# Altium project MC1_Board.PrjPcb (part 1 of 2)
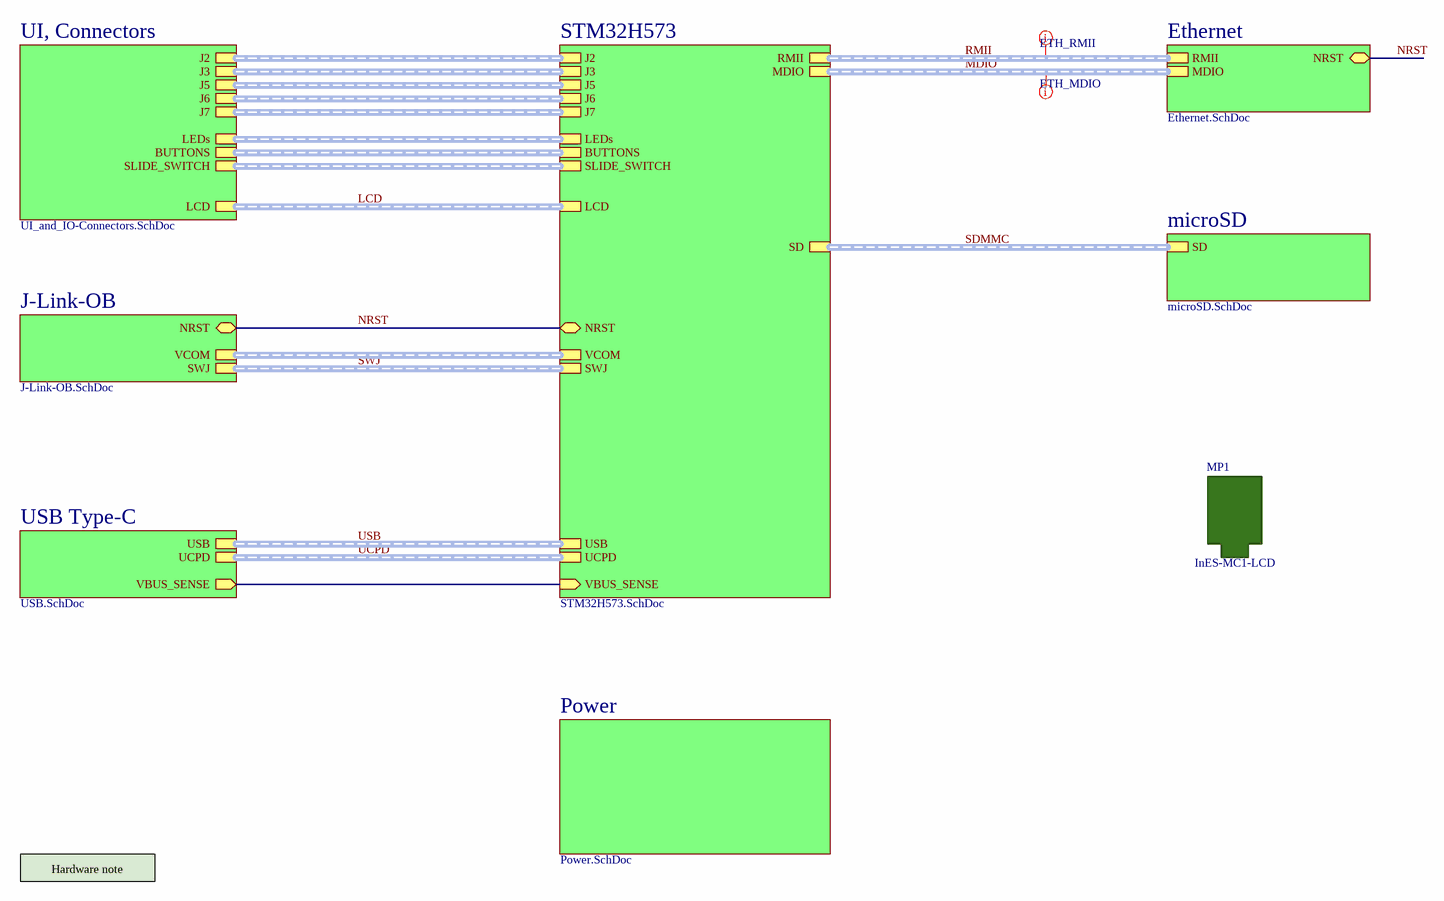
[diagram p0: MC1_Board_Gen2.SchDoc]
ProjectAddressStreet: Technikumstrasse 9; ProjectAddressZipCity: CH-8401 Winterthur; ProjectAuthor: frtt; ProjectInstitute: Institute of Embedded Systems; ProjectOrganization: Zurich University of Applied Sciences; ProjectPcbRevision: 2.01; ProjectProjectName: MC1-Board; ProjectRepository: https://github.zhaw.ch/InES/MC1_STM32H5; ProjectSchematicDate: Can be used to set a manual schematic date. Set the value of the schematic document parameter DocumentDate to =ProjectSchematicDate; ProjectSchematicDocNo: n/a; ProjectSchematicRevision: 2.01; ProjectSchematicSheetNameCommon: MC1-Board Schematic
8 sheets, 199 parts. Net scope: hierarchical (ports join the sheet entries above them; power ports are global).
Board file: MC1_Board.PcbDoc
Sheets:
  MC1_Board_Gen2.SchDoc
    USB Type-C = USB.SchDoc
    Power = Power.SchDoc
    UI, Connectors = UI_and_IO-Connectors.SchDoc
    J-Link-OB = J-Link-OB.SchDoc
    Ethernet = Ethernet.SchDoc
    microSD = microSD.SchDoc
    STM32H573 = STM32H573.SchDoc

## Sheet MC1_Board_Gen2.SchDoc
size A3; SheetNumber: 1; SheetTotal: 8; DocumentSheetName: MC1-Board Gen2; DocumentAuthor: frtt

### Parts
MP1  InES-MC1-LCD  [InES_MC1-LCD_Board_1.01-2.5-0]  (no BOM)

### Sub-sheets
Ethernet = Ethernet.SchDoc: RMII (harness RMII), NRST (bidir), MDIO (harness MDIO)
J-Link-OB = J-Link-OB.SchDoc: SWJ (harness SWJ), VCOM (harness VCOM), NRST (bidir)
microSD = microSD.SchDoc: SD (harness SD-Bus)
Power = Power.SchDoc: no entries
STM32H573 = STM32H573.SchDoc: NRST (bidir), RMII (harness RMII), SD (harness SD-Bus), USB (harness USB), SWJ (harness SWJ), LCD (harness LCD), VCOM (harness VCOM), VBUS_SENSE (in), J7 (harness J7), J5 (harness J5), J2 (harness J2), J3 (harness J3), J6 (harness J6), LEDs (harness LEDs), BUTTONS (harness BUTTONS), SLIDE_SWITCH (harness SLIDE_SWITCH), UCPD (harness UCPD), MDIO (harness MDIO)
UI, Connectors = UI_and_IO-Connectors.SchDoc: LCD (harness LCD), J2 (harness J2), J3 (harness J3), J5 (harness J5), J6 (harness J6), J7 (harness J7), SLIDE_SWITCH (harness SLIDE_SWITCH), LEDs (harness LEDs), BUTTONS (harness BUTTONS)
USB Type-C = USB.SchDoc: USB (harness USB), VBUS_SENSE (out), UCPD (harness UCPD)

### Nets
NRST: sheet J-Link-OB/NRST, sheet Ethernet/NRST, sheet STM32H573/NRST
NetC41_1: sheet USB Type-C/VBUS_SENSE, sheet STM32H573/VBUS_SENSE

### Buses and harness runs
harness LCD = sheet STM32H573/LCD = sheet UI, Connectors/LCD
harness MDIO = sheet Ethernet/MDIO = sheet STM32H573/MDIO
harness RMII = sheet Ethernet/RMII = sheet STM32H573/RMII
harness SDMMC = sheet microSD/SD = sheet STM32H573/SD
harness sheet J-Link-OB/VCOM = sheet STM32H573/VCOM
harness sheet STM32H573/BUTTONS = sheet UI, Connectors/BUTTONS
harness sheet STM32H573/J2 = sheet UI, Connectors/J2
harness sheet STM32H573/J3 = sheet UI, Connectors/J3
harness sheet STM32H573/J5 = sheet UI, Connectors/J5
harness sheet STM32H573/J6 = sheet UI, Connectors/J6
harness sheet STM32H573/J7 = sheet UI, Connectors/J7
harness sheet STM32H573/LEDs = sheet UI, Connectors/LEDs
harness sheet STM32H573/SLIDE_SWITCH = sheet UI, Connectors/SLIDE_SWITCH
harness SWJ = sheet J-Link-OB/SWJ = sheet STM32H573/SWJ
harness UCPD = sheet STM32H573/UCPD = sheet USB Type-C/UCPD
harness USB = sheet STM32H573/USB = sheet USB Type-C/USB

### Layout directives
net class ETH_RMII: (no net found under the mark)
net class ETH_MDIO: (no net found under the mark)

### Notes on the sheet
- Hardware note
- Rev
- Date
- Sign
- Release Notes
- Sheet Name
- Project Name
- Variant:
- Doc Number
- File:
- Repo:
- Revision:
- Date:
- Author:
- VC Rev:
- Sheet

### Library data of the parts
MP1 = CMP-00030-00039-1: Add-On Card, MC1 LCD Board 1.01, InES; Case/Package: n/a; Type: Add-On Card; Mounting Technology: Pluggable

## Sheet USB.SchDoc
size A3; SheetNumber: 7; SheetTotal: 8; DocumentSheetName: USB Type-C UFP; DocumentAuthor: frtt
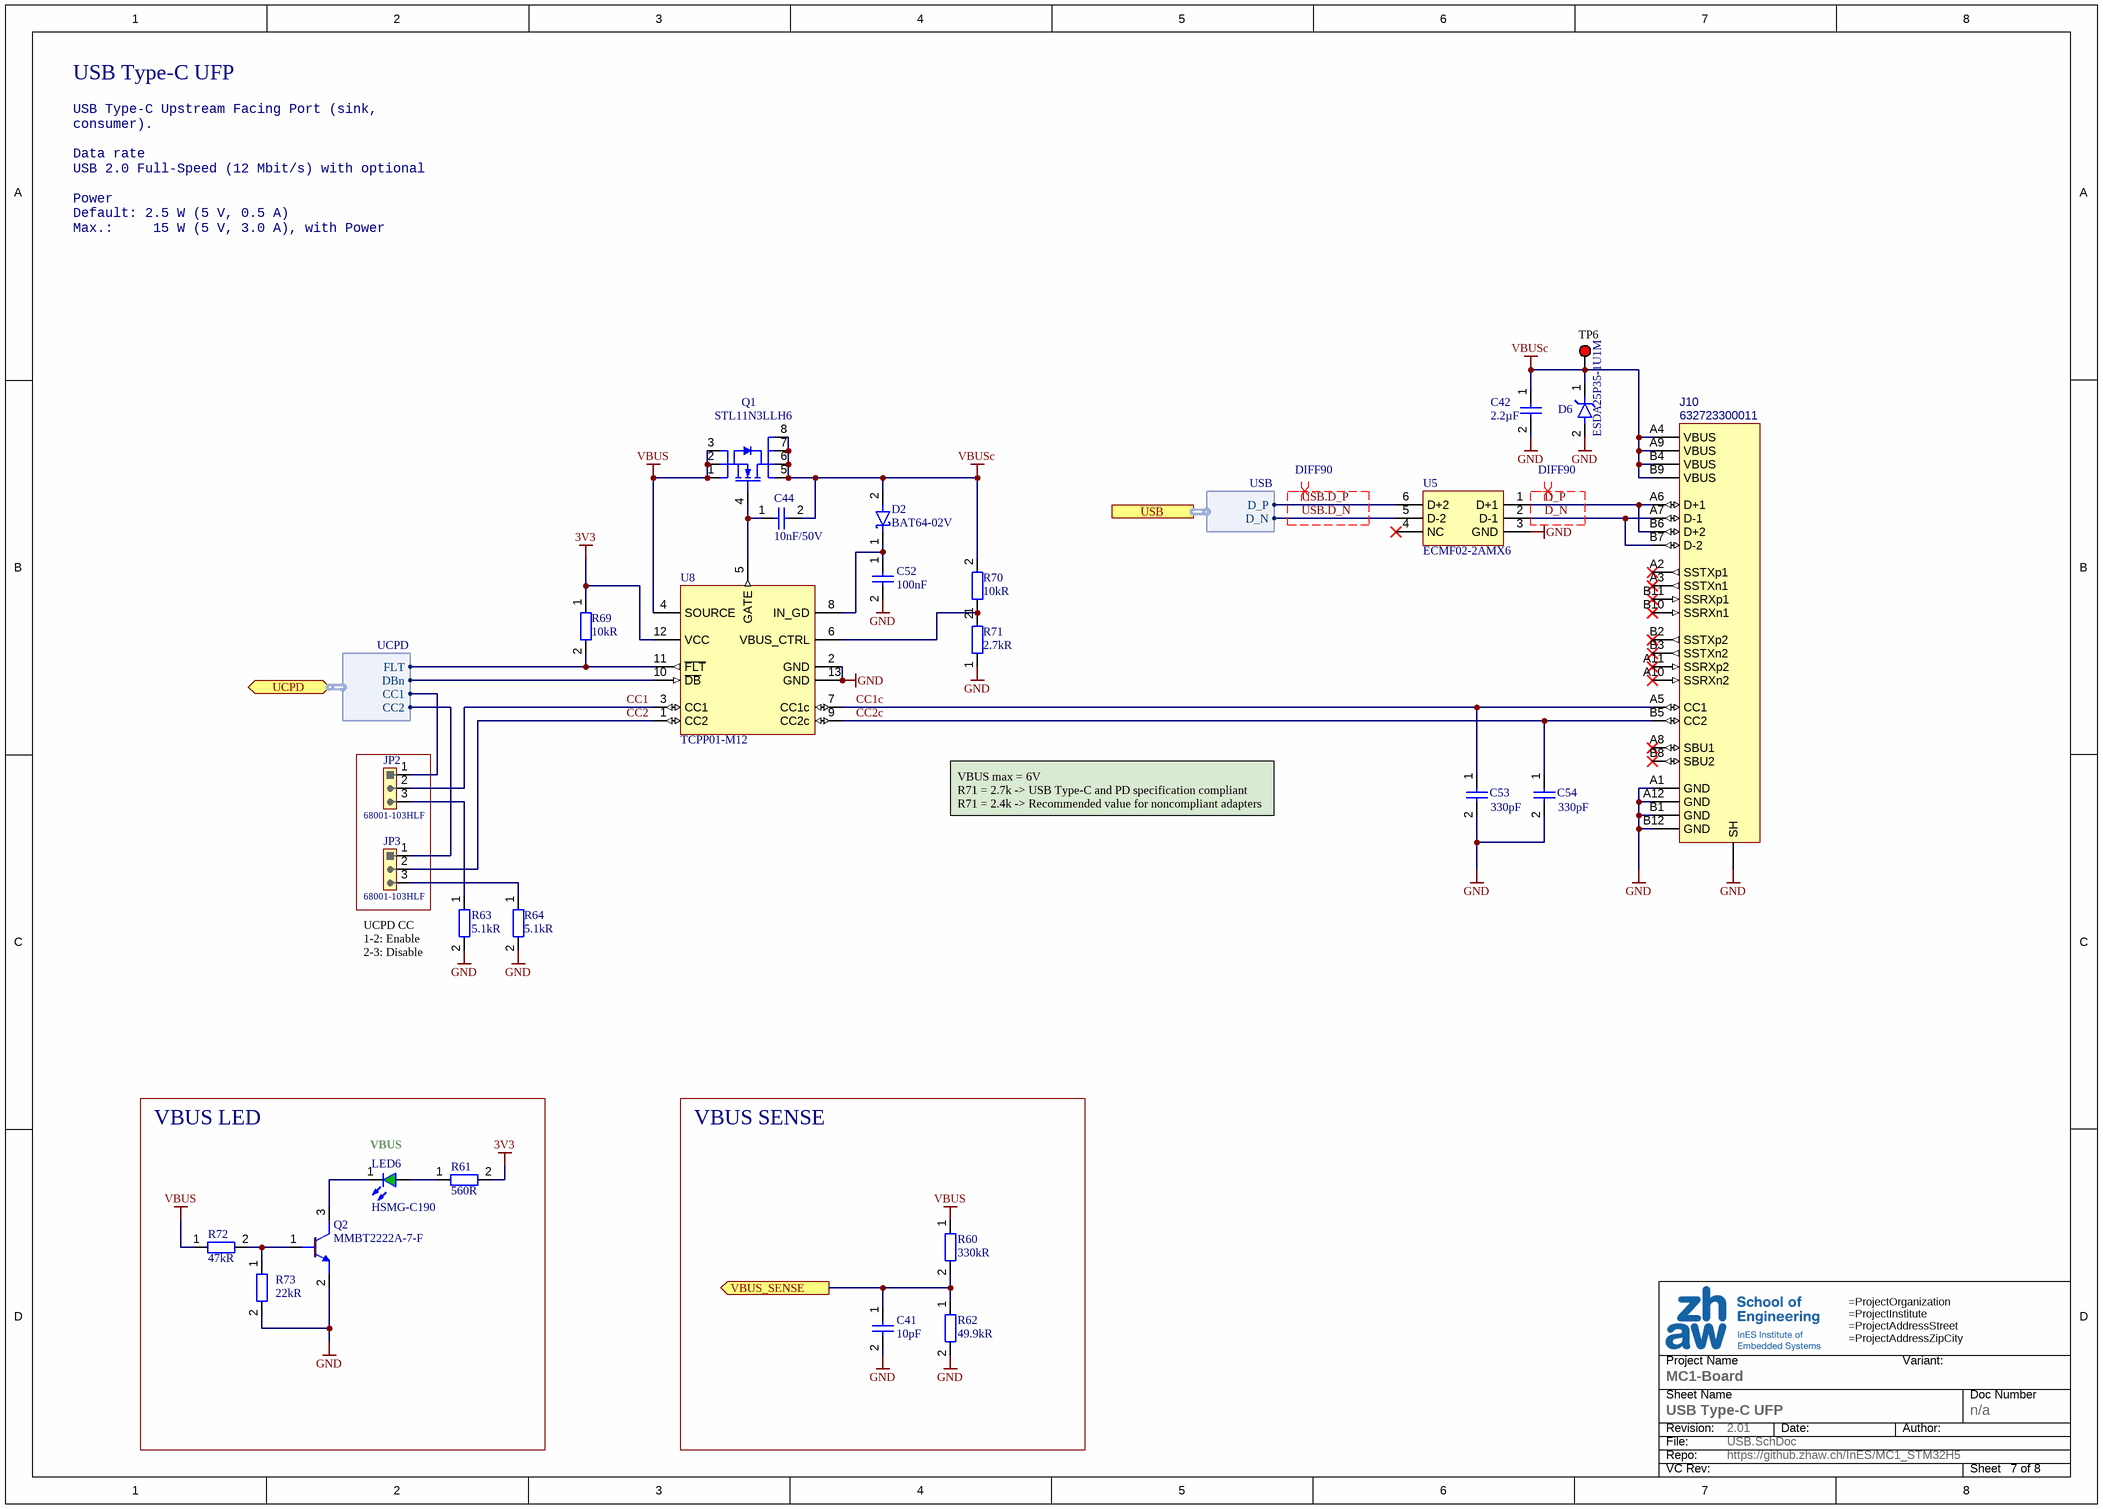
[diagram p1: USB.SchDoc]

### Parts
C41  value 10pF  [CAPC1608X80N]  (hidden comment: 10pF/50V)
C42  value 2.2µF  [CAPC1608X80N]  (hidden comment: 2.2uF/10V)
C44  10nF/50V  [CAPC1005X50N]
C52  value 100nF  [CAPC1608X80N]  (hidden comment: 100nF/50V)
C53  value 330pF  [CAPC1005X50N]  (hidden comment: 330pF/50V)
C54  value 330pF  [CAPC1005X50N]  (hidden comment: 330pF/50V)
D2  BAT64-02V  [SODFL160X65-2N]
D6  ESDA25P35-1U1M  [DFN110P160X60-2L]
J10  632723300011  [WE_632723300011]
JP2  68001-103HLF  [HD254_1x3_MV]
JP3  68001-103HLF  [HD254_1x3_MV]
LED6  HSMG-C190  [LEDSC160X80X80-2Lgn]
Q1  STL11N3LLH6  [PowerFLAT65P300X315X80-8+1]
Q2  MMBT2222A-7-F  [SOT95P235X120-3N]
R60  330kR  [RESC1608X45N]
R61  560R  [RESC1608X45N]
R62  49.9kR  [RESC1608X45N]
R63  5.1kR  [RESC1005X35N]
R64  5.1kR  [RESC1005X35N]
R69  10kR  [RESC1005X35N]
R70  10kR  [RESC1005X35N]
R71  2.7kR  [RESC1005X35N]
R72  47kR  [RESC1608X45N]
R73  22kR  [RESC1608X45N]
TP6  5000  [KSTN-5000]  (value not drawn)
U5  ECMF02-2AMX6  [QFN50P150X170X50-6N]
U8  TCPP01-M12  [QFN50P300X300X100-13T145X145N]

### Blocks framed on the sheet
VBUS LED: LED6 Q2 R61 R72 R73
VBUS SENSE: C41 R60 R62

### Ports
UCPD (bidir, harness UCPD), USB (harness USB), VBUS_SENSE (out)

### Harnesses
USB: D_P, D_N
UCPD: CC1, CC2, DBn, FLT

### Nets
3V3: R61.2 R69.1 U8.12(VCC)
GND: C41.2 C42.2 C52.2 C53.2 C54.2 D6.2(A) J10.A1(GND) J10.A12(GND) J10.B1(GND) J10.B12(GND) J10.SH Q2.2(E) R62.2 R63.2 R64.2 R71.1 R73.2 U5.3(GND) U8.2(GND) U8.13(GND)
VBUS: Q1.1(S) Q1.2(S) Q1.3(S) R60.1 R72.1 U8.4(SOURCE)
VBUSc: C42.1 C44.2 D2.2(Anode) D6.1(A) J10.A4(VBUS) J10.A9(VBUS) J10.B4(VBUS) J10.B9(VBUS) Q1.5(D) Q1.6(D) Q1.7(D) Q1.8(D) R70.2 TP6.1
CC1: JP2.2 U8.3(CC1)
CC1c: C53.1 J10.A5(CC1) U8.7(CC1c)
CC2: JP3.2 U8.1(CC2)
CC2c: C54.1 J10.B5(CC2) U8.9(CC2c)
D_N: J10.A7(D-1) J10.B7(D-2) U5.2(D-1)
D_P: J10.A6(D+1) J10.B6(D+2) U5.1(D+1)
UCPD.CC1: JP2.1 ; port UCPD.CC1
UCPD.CC2: JP3.1 ; port UCPD.CC2
UCPD.DBn: U8.10(~{DB}) ; port UCPD.DBn
UCPD.FLT: R69.2 U8.11(~{FLT}) ; port UCPD.FLT
USB.D_N: U5.5(D-2) ; port USB.D_N
USB.D_P: U5.6(D+2) ; port USB.D_P
NetC41_1: C41.1 R60.2 R62.1 ; port VBUS_SENSE
NetC44_1: C44.1 Q1.4(G) U8.5(GATE)
NetC52_1: C52.1 D2.1(Cathode) U8.8(IN_GD)
NetJP2_3: JP2.3 R63.1
NetJP3_3: JP3.3 R64.1
NetLED6_1: LED6.1(K) Q2.3(C)
NetLED6_2: LED6.2(A) R61.1
NetQ2_1: Q2.1(B) R72.2 R73.1
NetR70_1: R70.1 R71.2 U8.6(VBUS_CTRL)

Not connected (* = marked no-connect by the designer): J10 A2(SSTXp1)* A3(SSTXn1)* A8(SBU1)* A10(SSRXn2)* A11(SSRXp2)* B2(SSTXp2)* B3(SSTXn2)* B8(SBU2)* B10(SSRXn1)* B11(SSRXp1)*; U5 4(NC)*

### Layout directives
differential pair; differential pair class DIFF90: D_N, D_P, USB.D_N, USB.D_P

### Notes on the sheet
- USB Type-C UFP
- USB Type-C Upstream Facing Port (sink, consumer).
  Data rate
  USB 2.0 Full-Speed (12 Mbit/s) with optional
  Power
  Default: 2.5 W (5 V, 0.5 A)
  Max.:     15 W (5 V, 3.0 A), with Power Delivery (PD)
- VBUS max = 6V
  R71 = 2.7k -> USB Type-C and PD specification compliant
  R71 = 2.4k -> Recommended value for noncompliant adapters
- (near R63) UCPD CC
  1-2: Enable
  2-3: Disable
- (near LED6) VBUS
- Sheet Name
- Project Name
- Variant:
- Doc Number
- File:
- Repo:
- Revision:
- Date:
- Author:
- VC Rev:
- Sheet

### Library data of the parts
C41 = CMP-001-00014-21: Cap MLCC, 10pF, 50V, C0G, 5%, 0603; Type: MLCC; Case/Package: 0603; Voltage Rating: 50V; Case Code (Metric): 1608; Mounting Technology: SMD; Tolerance: 5%; Dielectricum: C0G
C42 = CMP-00353-4: Cap MLCC, 2.2uF, 10V, X7R, 10%, 0603; Case Code (Metric): 1608; Case/Package: 0603; Tolerance: 10%; Mounting Technology: SMD; Type: MLCC; Dielectricum: X7R; Voltage Rating: 10V
C44 = CMP-001-00069-21: Cap MLCC, 10nF, 50V, X7R, 10%, 0402; Tolerance: 10%; Type: MLCC; Voltage Rating: 50V; Case Code (Metric): 1005; Mounting Technology: SMD; Case/Package: 0402; Dielectricum: X7R; Value: 10nF
C52 = CMP-001-00017-21: Cap MLCC, 100nF, 50V, X7R, 10%, 0603; Voltage Rating: 50V; Dielectricum: X7R; Tolerance: 10%; Type: MLCC; Mounting Technology: SMD; Case Code (Metric): 1608; Case/Package: 0603
C53 C54 = CMP-001-00094-19: Cap MLCC, 330pF, 50V, C0G, 5%, 0402; Type: MLCC; Dielectricum: C0G; Voltage Rating: 50V; Case/Package: 0402; Mounting Technology: SMD; Tolerance: 5%; Case Code (Metric): 1005
D2 = CMP-004-00068-26: Schottky Diode, 40V, 250mA, SOD-523FL-2; Type: SOD123; Voltage: 40V; Current: 250mA; Mounting Technology: SMD; Case/Package: SOD-523FL-2
D6 = CMP-004-00023-26: TVS Diode, unidirectional, 22V, 35A, 1400W, 1610 (0603); Peak Power: 1.4kW; Connection: single; Size: L1.6B1H0.55; Peak Current: 35A; Rated Voltage: 22V; Direction: unidirectional; Case Code (Metric): 1610; Case/Package: 0603; Mounting Technology: SMD
J10 = CMP-220-000000-8: USB-C, 24 Pin, Pitch 500um, 20V, Horizontal, SMD/THT, L11.2B8.74H2.96; Manufacturer: Wurth Elektronik; Pitch: 500µm; Max Current: 5A; Gender: Female; Connection: Pluggable; Pin Mapping: 2x12; Family Name: WR-USB Connectors; Mounting Technology: SMD/THT; Angle: Horizontal; Type: USB-C; Pins: 24; Max Voltage: 20V; Size: L11.2B8.74H2.96
JP2 JP3 = CMP-002-00127-12: Header, 1x3 Pin, Pitch 2.54mm, Male, Vertical, THT; Manufacturer: FCI; Mating Length: 5.84mm; Plating: Gold; Overall Contact Length: 11.43mm; Termination Length: 3.05mm; Pitch Row: 2.54mm; Pin Mapping: 1x3; Pins: 3; Mounting Technology: THT; Angle: Vertical; Pitch: 2.54mm; Insulation Height: 2.54mm; Gender: Male
LED6 = CMP-007-00013-24: LED, Green, 20mA, 2.2V, 0603; Case/Package: 0603; Rated Current: 20mA; Forward Voltage: 2.2V; Size: L1.6B0.8H0.8; Color: Green; Mounting Technology: SMD
Q1 = CMP-00725-7: MOSFET N-enh, 30V, 11A, 44Ap, 6mR, 50W, PowerFLAT 3.3 x 3.3; Resistance: 6m; Current peak: 44A; Type: MOSFET; Power: 50W; Case/Package: PowerFLAT 3.3 x 3.3; Mounting Technology: SMD; Current: 11A; Technology: N-enhancement; Voltage: 30V; Size: L3.15B3.0H0.8
Q2 = CMP-013-00084-8: Transistor NPN, 40V, 600mA, 310mW, SOT-23-3; Current: 600mA; Case/Package: SOT-23-3; Voltage: 40V; Power: 310mW; Type: Transistor; Mounting Technology: SMD; Technology: NPN
R60 = CMP-009-00448-5: Res, 330kR, 1%, 0.1W, 0603; Value: 330k; Voltage Rating: 75V; Power: 100mW; Temperature Coefficient: 100ppm; Case/Package: 0603; Type: Fixed; Case Code (Metric): 1608; Tolerance: 1%; Mounting Technology: SMD
R61 = CMP-00862-1: Res, 560R, 1%, 100mW, 0603; Voltage Rating: 75V; Value: 560; Tolerance: 1%; Case/Package: 0603; Mounting Technology: SMD; Type: Fixed; Power: 100mW; Case Code (Metric): 1608
R62 = CMP-00778-2: Res, 49.9kR, 1%, 100mW, 0603; Value: 49.9k; Voltage Rating: 75V; Temperature Coefficient: 100ppm; Case Code (Metric): 1608; Power: 100mW; Case/Package: 0603; Tolerance: 1%; Type: Fixed; Size: L1.6B0.8H0.45; Mounting Technology: SMD
R63 R64 = CMP-009-00255-13: Res, 5.1kR, 1%, 0.063W, 0402; Voltage Rating: 50V; Value: 5.1k; Power: 63mW; Case/Package: 0402; Case Code (Metric): 1005; Tolerance: 1%; Mounting Technology: SMD; Type: Fixed
R69 R70 = CMP-009-00298-12: Res, 10kR, 1%, 0.063W, 0402; Value: 10k; Power: 63mW; Voltage Rating: 50V; Tolerance: 1%; Type: Fixed; Case Code (Metric): 1005; Case/Package: 0402; Mounting Technology: SMD
R71 = CMP-009-00214-21: Res, 2.7kR, 1%, 0.063W, 0402; Value: 2.7k; Power: 63mW; Voltage Rating: 50V; Type: Fixed; Mounting Technology: SMD; Case/Package: 0402; Case Code (Metric): 1005; Tolerance: 1%
R72 = CMP-009-00436-5: Res, 47kR, 1%, 0.1W, 0603; Voltage Rating: 75V; Temperature Coefficient: 100ppm/°C; Power: 100mW; Value: 47k; Case/Package: 0603; Case Code (Metric): 1608; Mounting Technology: SMD; Type: Fixed; Tolerance: 1%
R73 = CMP-009-00438-5: Res, 22kR, 1%, 0.1W, 0603; Voltage Rating: 75V; Temperature Coefficient: 100ppm; Value: 22k; Power: 100mW; Tolerance: 1%; Case Code (Metric): 1608; Mounting Technology: SMD; Type: Fixed; Case/Package: 0603
TP6 = CMP-00067-9: Test Point, Red, D2.5H4.6, THT, closed ring D1.25; Mounting Technology: THT; Color: Red; Size: D2.5H4.6
U5 = CMP-00721-6: ESD Common Mode Filter, Diodes and CM-Chocke, 6Vbr, 1.8ohm, 8kVpp, uQFN-6L, USB 2.0, MIPI D-PHY/MDDI; Specification: 6Vbr, 1.8ohm, 8kVpp; Type: ESD Common Mode Filter; Size: L1.7B1.5H0.5; Case/Package: uQFN-6L; Mounting Technology: SMD; Connection: Diodes and CM-Chocke
U8 = CMP-00861-5: USB Type-C and Power Delivery Protection, 2.7...22V, QFN-12; Max Supply Voltage: 22V; Min Supply Voltage: 2.7V; Case/Package: QFN-12; Mounting Technology: SMD; Function: USB Type-C and Power Delivery Protection; Size: L3.00B3.00H0.90

## Sheet Power.SchDoc
size A3; SheetNumber: 3; SheetTotal: 8; DocumentSheetName: Power; DocumentAuthor: frtt
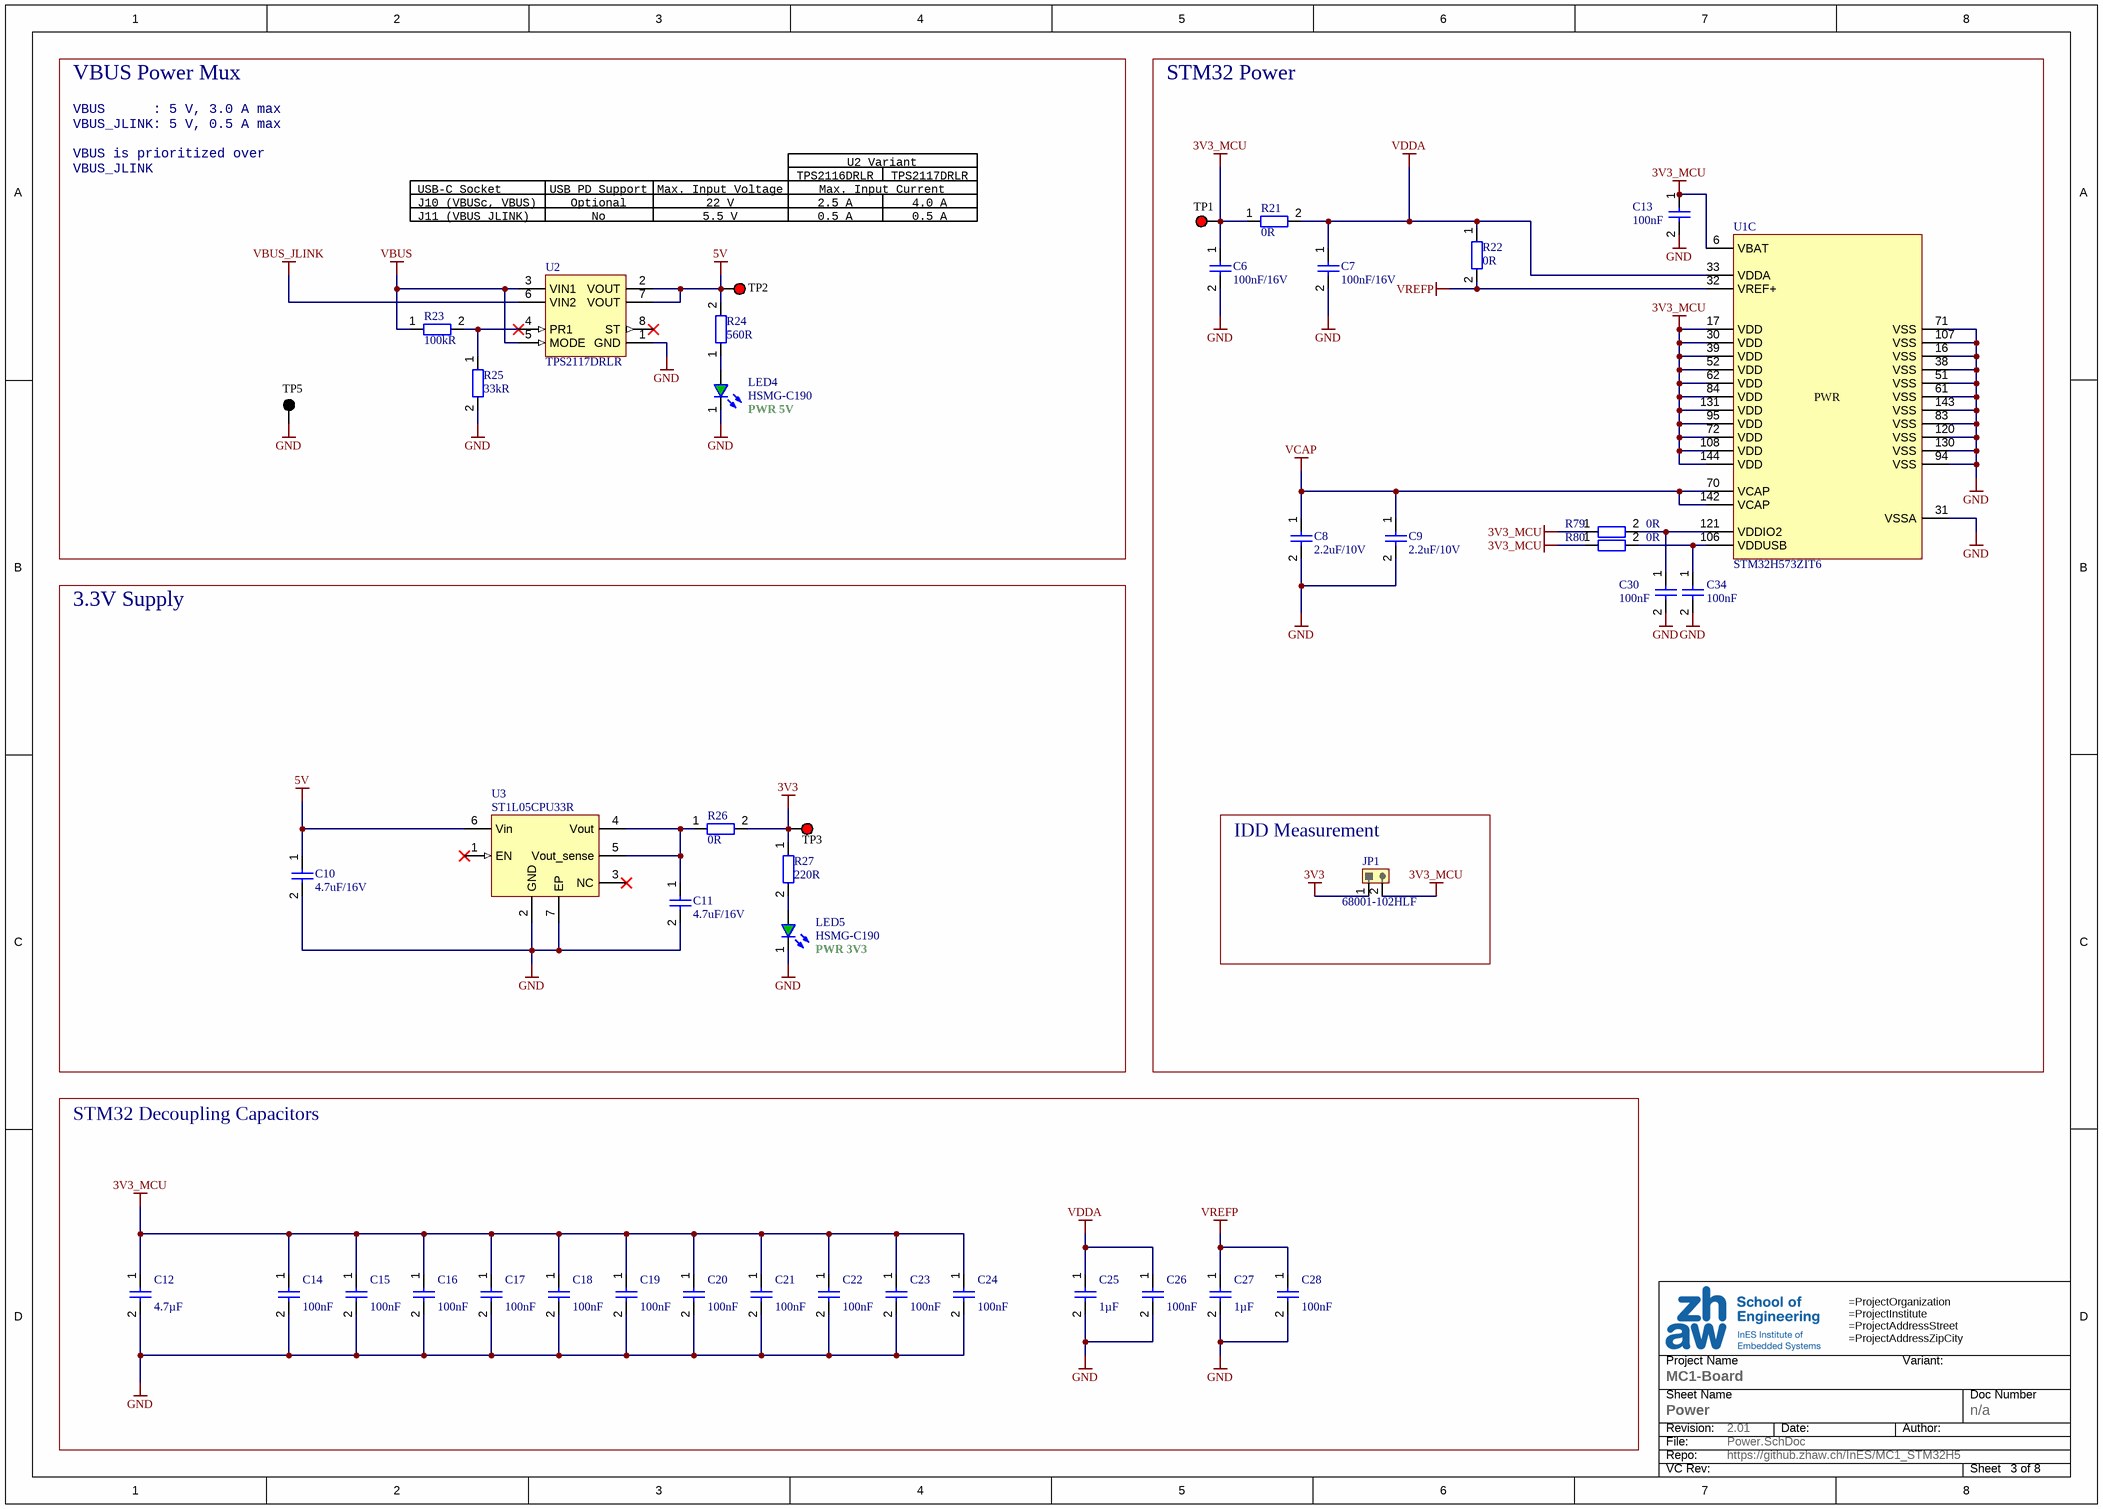
[diagram p2: Power.SchDoc]

### Parts
C6  100nF/16V  [CAPC1005X50N]
C7  100nF/16V  [CAPC1005X50N]
C8  2.2uF/10V  [CAPC1608X80N]
C9  2.2uF/10V  [CAPC1608X80N]
C10  4.7uF/16V  [CAPC1608X80N]
C11  4.7uF/16V  [CAPC1608X80N]
C12  value 4.7µF  [CAPC1608X80N]  (hidden comment: 4.7uF/16V)
C13  value 100nF  [CAPC1005X50N]  (hidden comment: 100nF/16V)
C14  value 100nF  [CAPC1005X50N]  (hidden comment: 100nF/16V)
C15  value 100nF  [CAPC1005X50N]  (hidden comment: 100nF/16V)
C16  value 100nF  [CAPC1005X50N]  (hidden comment: 100nF/16V)
C17  value 100nF  [CAPC1005X50N]  (hidden comment: 100nF/16V)
C18  value 100nF  [CAPC1005X50N]  (hidden comment: 100nF/16V)
C19  value 100nF  [CAPC1005X50N]  (hidden comment: 100nF/16V)
C20  value 100nF  [CAPC1005X50N]  (hidden comment: 100nF/16V)
C21  value 100nF  [CAPC1005X50N]  (hidden comment: 100nF/16V)
C22  value 100nF  [CAPC1005X50N]  (hidden comment: 100nF/16V)
C23  value 100nF  [CAPC1005X50N]  (hidden comment: 100nF/16V)
C24  value 100nF  [CAPC1005X50N]  (hidden comment: 100nF/16V)
C25  value 1µF  [CAPC1608X80N]  (hidden comment: 1uF/16V)
C26  value 100nF  [CAPC1005X50N]  (hidden comment: 100nF/16V)
C27  value 1µF  [CAPC1608X80N]  (hidden comment: 1uF/16V)
C28  value 100nF  [CAPC1005X50N]  (hidden comment: 100nF/16V)
C30  value 100nF  [CAPC1005X50N]  (hidden comment: 100nF/16V)
C34  value 100nF  [CAPC1005X50N]  (hidden comment: 100nF/16V)
JP1  68001-102HLF  [HD254 _1x2_MV]
LED4  HSMG-C190  [LEDSC160X80X80-2Lgn]
LED5  HSMG-C190  [LEDSC160X80X80-2Lgn]
R21  0R  [RESC1608X45N]
R22  0R  [RESC1608X45N]
R23  100kR  [RESC1608X45N]
R24  560R  [RESC1608X45N]
R25  33kR  [RESC1608X45N]
R26  0R  [RESC1608X45N_JUMPER]
R27  220R  [RESC1608X45N]
R79  0R  [RESC1005X35N_JUMPER]
R80  0R  [RESC1005X35N_JUMPER]
TP1  5000  [KSTN-5000]  (value not drawn)
TP2  5000  [KSTN-5000]  (value not drawn)
TP3  5000  [KSTN-5000]  (value not drawn)
TP5  5001  [KSTN-5001]  (value not drawn)
U1  STM32H573ZIT6  [LQFP50P2200X2200X160-144N]  (part C of 3)
U2  TPS2117DRLR  [SOTFL50P160X60-8L]
U3  ST1L05CPU33R  [SON95P300X95-7T250X160L]

### Blocks framed on the sheet
VBUS Power Mux: LED4 R23-R25 TP2 TP5 U2
STM32 Power: C6-C9 C13 C30 C34 R21 R22 R79 R80 TP1 U1
3.3V Supply: C10 C11 LED5 R26 R27 TP3 U3
IDD Measurement: JP1
STM32 Decoupling Capacitors: C12 C14-C28

### Nets
3V3: JP1.1 R26.2 R27.1 TP3.1
3V3_MCU: C6.1 C12.1 C13.1 C14.1 C15.1 C16.1 C17.1 C18.1 C19.1 C20.1 C21.1 C22.1 C23.1 C24.1 JP1.2 R21.1 R79.1 R80.1 TP1.1 U1.6(VBAT) U1.17(VDD) U1.30(VDD) U1.39(VDD) U1.52(VDD) U1.62(VDD) U1.72(VDD) U1.84(VDD) U1.95(VDD) U1.108(VDD) U1.131(VDD) U1.144(VDD)
5V: C10.1 R24.2 TP2.1 U2.2(VOUT) U2.7(VOUT) U3.6(Vin)
GND: C6.2 C7.2 C8.2 C9.2 C10.2 C11.2 C12.2 C13.2 C14.2 C15.2 C16.2 C17.2 C18.2 C19.2 C20.2 C21.2 C22.2 C23.2 C24.2 C25.2 C26.2 C27.2 C28.2 C30.2 C34.2 LED4.1(K) LED5.1(K) R25.2 TP5.1 U1.16(VSS) U1.31(VSSA) U1.38(VSS) U1.51(VSS) U1.61(VSS) U1.71(VSS) U1.83(VSS) U1.94(VSS) U1.107(VSS) U1.120(VSS) U1.130(VSS) U1.143(VSS) U2.1(GND) U3.2(GND) U3.7(EP)
VBUS: R23.1 U2.3(VIN1) U2.5(MODE)
VBUS_JLINK: U2.6(VIN2)
VCAP: C8.1 C9.1 U1.70(VCAP) U1.142(VCAP)
VDDA: C7.1 C25.1 C26.1 R21.2 R22.1 U1.33(VDDA)
VREFP: C27.1 C28.1 R22.2 U1.32(VREF+)
NetC11_1: C11.1 R26.1 U3.4(Vout) U3.5(Vout_sense)
NetC30_1: C30.1 R79.2 U1.121(VDDIO2)
NetC34_1: C34.1 R80.2 U1.106(VDDUSB)
NetLED4_2: LED4.2(A) R24.1
NetLED5_2: LED5.2(A) R27.2
NetR23_2: R23.2 R25.1 U2.4(PR1)

Not connected (* = marked no-connect by the designer): U2 8(ST)*; U3 1(EN)* 3(NC)*

### Notes on the sheet
- VBUS      : 5 V, 3.0 A max
  VBUS_JLINK: 5 V, 0.5 A max
  VBUS is prioritized over VBUS_JLINK
- U2 Variant
- TPS2116DRLR
- TPS2117DRLR
- USB-C Socket
- J10 (VBUSc, VBUS)
- J11 (VBUS_JLINK)
- USB PD Support
- Optional
- No
- Max. Input Voltage
- 22 V
- 5.5 V
- Max. Input Current
- 2.5 A
- 0.5 A
- 4.0 A
- (near LED4) PWR 5V
- (near LED5) PWR 3V3
- Sheet Name
- Project Name
- Variant:
- Doc Number
- File:
- Repo:
- Revision:
- Date:
- Author:
- VC Rev:
- Sheet
- (in symbol CMP-00715-8, part C) PWR

### Library data of the parts
C6 C7 C13-C24 C26 C28 C30 C34 = CMP-001-00001-22: Cap MLCC, 100nF, 16V, X7R, 5%,  0402; Dielectricum: X7R; Type: MLCC; Case Code (Metric): 1005; Voltage Rating: 16V; Case/Package: 0402; Mounting Technology: SMD; Tolerance: 5%
  C6 C7: Value: 100nF
C8 C9 = CMP-00353-4: Cap MLCC, 2.2uF, 10V, X7R, 10%, 0603; Value: 2.2µF; Case Code (Metric): 1608; Case/Package: 0603; Tolerance: 10%; Mounting Technology: SMD; Type: MLCC; Dielectricum: X7R; Voltage Rating: 10V
C10 C11 = CMP-00443-4: Cap MLCC, 4.7uF, 16V, X7R, 10%, 0603; Value: 4.7µF; Voltage Rating: 16V; Mounting Technology: SMD; Tolerance: 10%; Case/Package: 0603; Type: MLCC; Case Code (Metric): 1608; Dielectricum: X7R
C12 = CMP-00443-4: Cap MLCC, 4.7uF, 16V, X7R, 10%, 0603; Voltage Rating: 16V; Mounting Technology: SMD; Tolerance: 10%; Case/Package: 0603; Type: MLCC; Case Code (Metric): 1608; Dielectricum: X7R
C25 C27 = CMP-001-00004-21: Cap MLCC, 1uF, 16V, X7R, 10%, 0603; Type: MLCC; Mounting Technology: SMD; Case Code (Metric): 1608; Tolerance: 10%; Dielectricum: X7R; Case/Package: 0603; Voltage Rating: 16V
JP1 = CMP-002-00102-13: Header, 1x2 Pin, Pitch 2.54mm, Male, Vertical, THT; Manufacturer: FCI; Mating Length: 5.84mm; Overall Contact Length: 11.43mm; Plating: Gold; Gender: Male; Insulation Height: 2.54mm; Pitch: 2.54mm; Mounting Technology: THT; Angle: Vertical; Pin Mapping: 1x2; Pins: 2; Termination Length: 3.05mm; Pitch Row: 2.54mm
LED4 LED5 = CMP-007-00013-24: LED, Green, 20mA, 2.2V, 0603; Case/Package: 0603; Rated Current: 20mA; Forward Voltage: 2.2V; Size: L1.6B0.8H0.8; Color: Green; Mounting Technology: SMD
R21 R22 = CMP-009-00006-33: Res, 0R, 1%, 0.1W, 0603; Value: 0; Voltage Rating: 75V; Power: 100mW; Type: Fixed; Case Code (Metric): 1608; Tolerance: 1%; Case/Package: 0603; Mounting Technology: SMD
R23 = CMP-009-00023-34: Res, 100kR, 1%, 0.1W, 0603; Power: 100mW; Value: 100k; Voltage Rating: 50V; Mounting Technology: SMD; Case/Package: 0603; Tolerance: 1%; Case Code (Metric): 1608; Type: Fixed
R24 = CMP-00862-1: as R61 on sheet USB; Tolerance: 1%; Case/Package: 0603; Mounting Technology: SMD; Type: Fixed; Power: 100mW; Case Code (Metric): 1608
R25 = CMP-009-00580-5: Res, 33kR, 1%, 0.1W, 0603; Power: 100mW; Voltage Rating: 75V; Value: 33k; Mounting Technology: SMD; Tolerance: 1%; Case/Package: 0603; Case Code (Metric): 1608; Type: Fixed
R26 = CMP-009-00006-33: Res, 0R, 1%, 0.1W, 0603; Voltage Rating: 75V; Value: 0; Power: 100mW; Tolerance: 1%; Type: Fixed; Case Code (Metric): 1608; Mounting Technology: SMD; Case/Package: 0603
R27 = CMP-009-00452-5: Res, 220R, 1%, 0.1W, 0603; Voltage Rating: 75V; Value: 220; Temperature Coefficient: 100ppm/°C; Power: 100mW; Mounting Technology: SMD; Case Code (Metric): 1608; Case/Package: 0603; Tolerance: 1%; Type: Fixed
R79 R80 = CMP-009-00148-34: Res, 0R, 1%, 0.063W, 0402; Value: 0; Power: 63mW; Voltage Rating: 50V; Case/Package: 0402; Tolerance: 1%; Mounting Technology: SMD; Case Code (Metric): 1005; Type: Fixed
TP1-TP3 = CMP-00067-9: as TP6 on sheet USB; Mounting Technology: THT; Color: Red; Size: D2.5H4.6
TP5 = CMP-00068-8: Test Point, Black, D2.5H4.6, THT, closed ring D1.25; Color: Black; Size: D2.5H4.6; Mounting Technology: THT
U1 = CMP-00715-8: Microcontroller, STM32, ARM Cortex-M33, 250MHz, Flash 2MB, RAM 640kB, 32bit, LQFP-144; Bit: 32; Min Supply Voltage: 1.71V; Max Supply Voltage: 3.6V; Frequency: 250MHz; Size: L20B20H1.6; Type: Microcontroller; RAM Size: 640kB; Case/Package: LQFP-144; Family: STM32, ARM Cortex-M33; Flash Size: 2MB; Mounting Technology: SMD
U2 = CMP-00817-5: Power MUX, 1.6V..5.5V, Power 1.6V..5V, 4A, SOT-583; Min Logic Voltage: 1.6V; Max Power Voltage: 5.5V; Mounting Technology: SMD; Function: Power MUX; Min Power Voltage: 1.6V; Case/Package: SOT-583; Max Logic Voltage: 5.5V; Size: L2.1B1.2H0.6; Max Current: 4A
U3 = CMP-00717-5: LinReg, Fixed, 3.3V, 1.3A, 5.5Vin, 300mV Dropout, DFN-6; Max Out Voltage: 3.3825V; Max In Voltage: 5.5V; Min Out Voltage: 3.2175V; Size: L3B3H0.9; Type: Fixed; Case/Package: DFN-6; Mounting Technology: SMD; Max Out Current: 1.3A; Dropout Voltage: 300mV

## Sheet UI_and_IO-Connectors.SchDoc
size A3; SheetNumber: 4; SheetTotal: 8; DocumentSheetName: I/O; DocumentAuthor: frtt
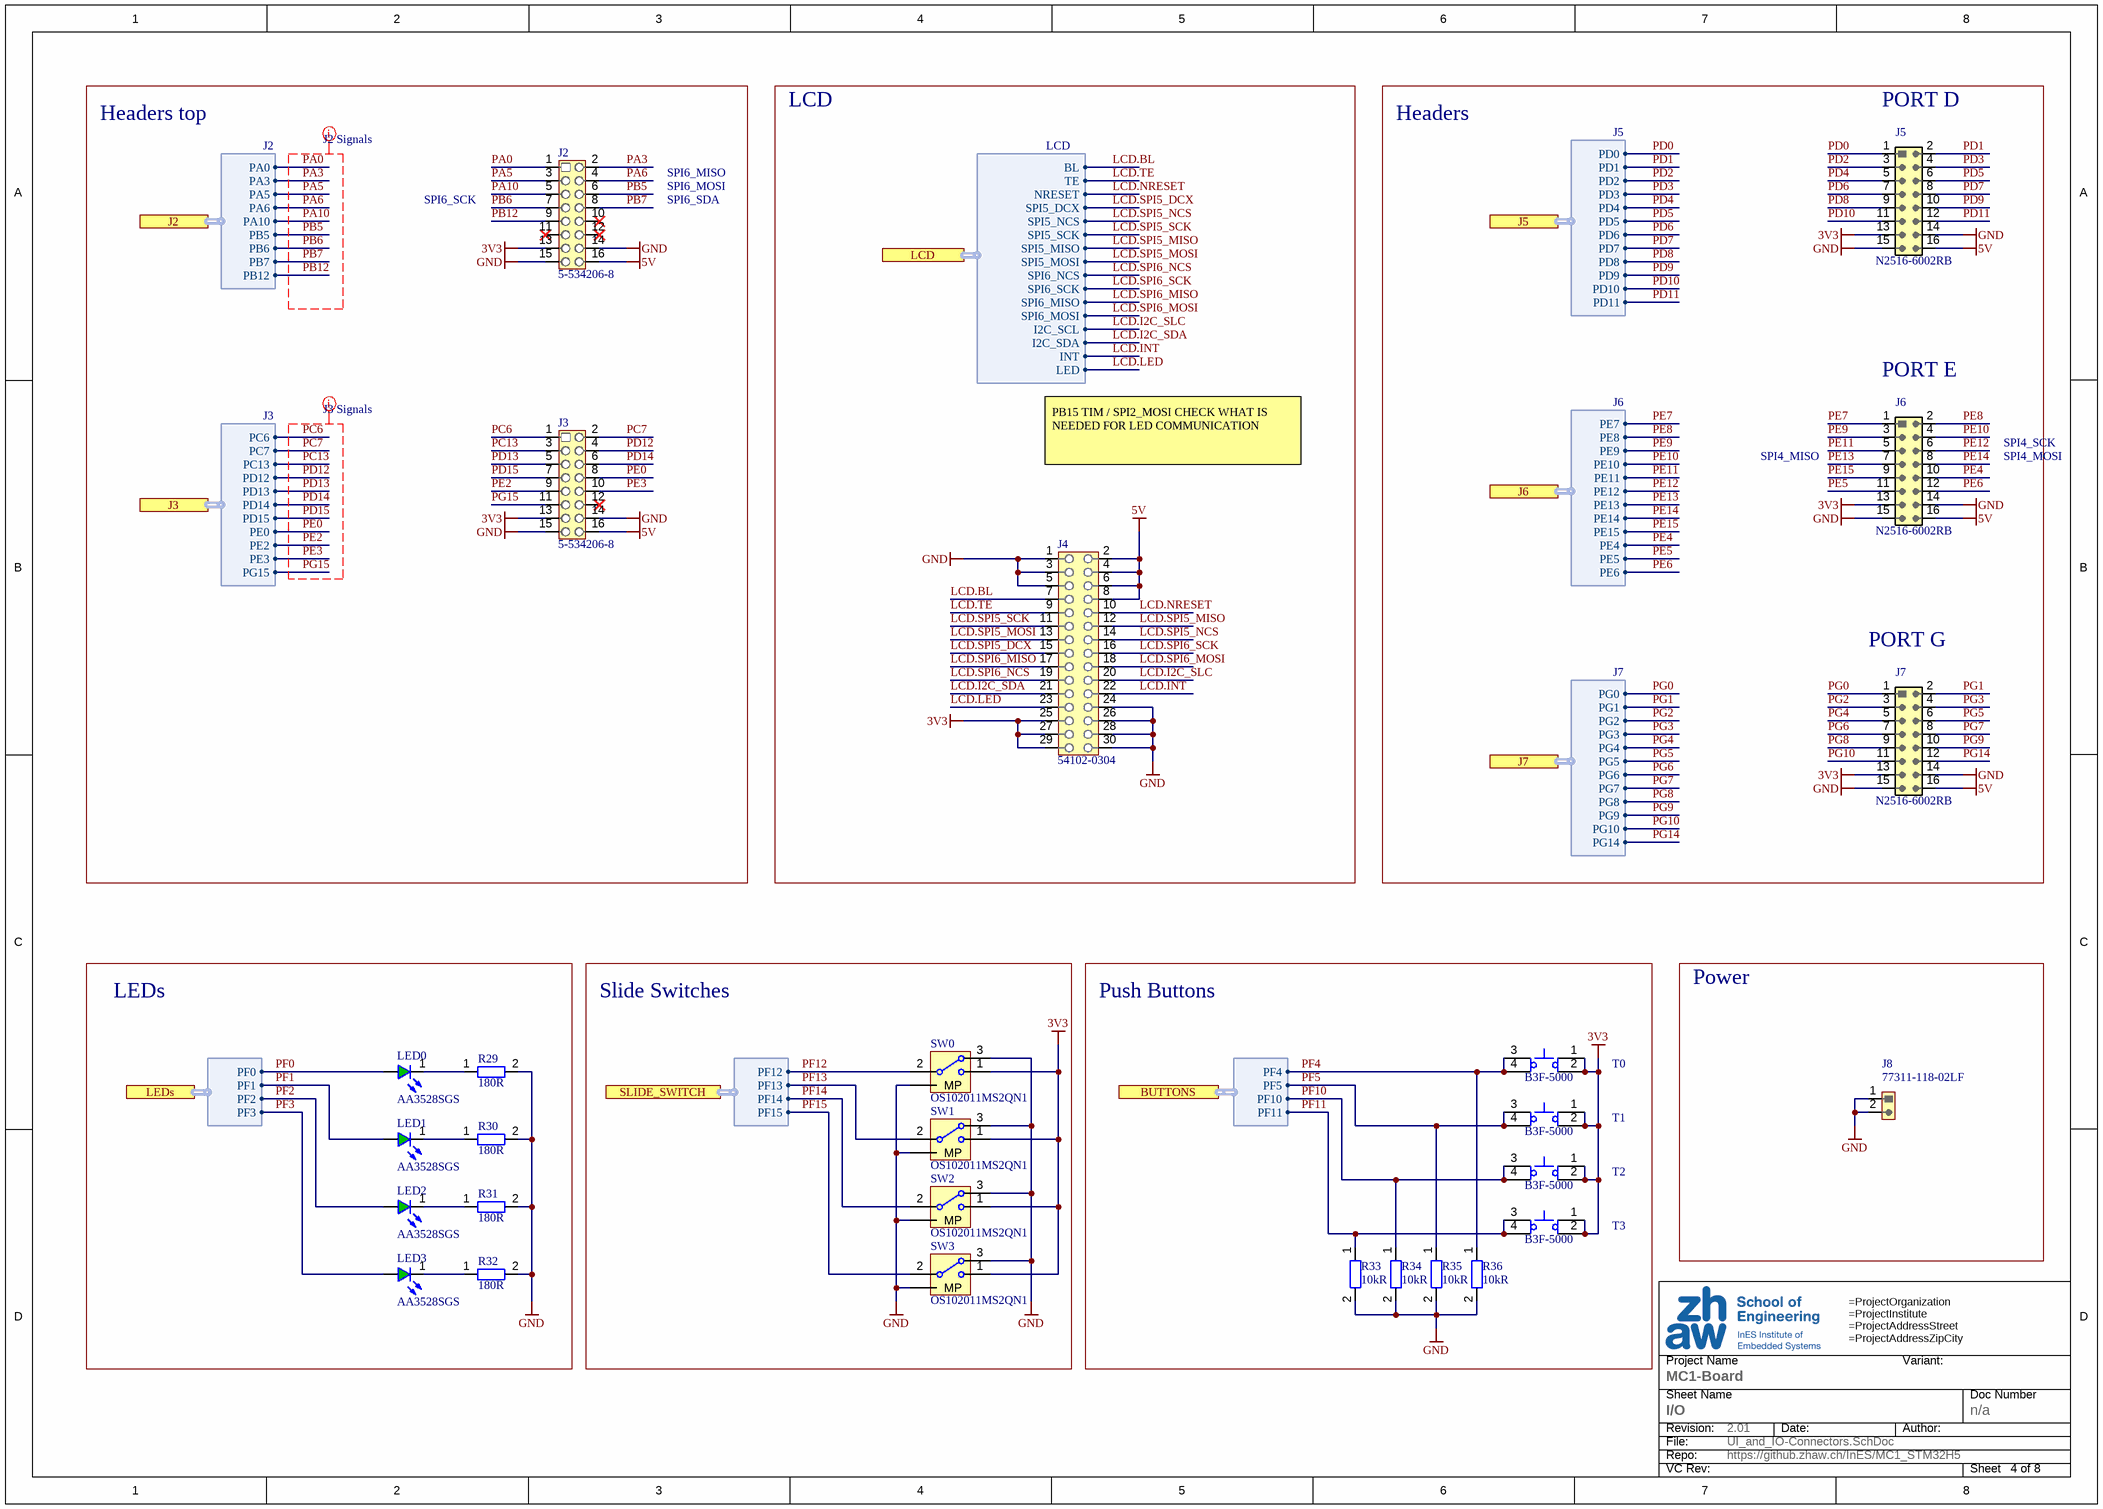
[diagram p3: UI_and_IO-Connectors.SchDoc]

### Parts
J2  5-534206-8  [HD254_2x8_FV_THT]
J3  5-534206-8  [HD254_2x8_FV_THT]
J4  54102-0304  [MOLEX_54102-0304]
J5  N2516-6002RB  [3M-N2516-6002RB]
J6  N2516-6002RB  [3M-N2516-6002RB]
J7  N2516-6002RB  [3M-N2516-6002RB]
J8  77311-118-02LF  [HD254 _1x2_MV]
LED0  AA3528SGS  [LEDM350X280X190-2]
LED1  AA3528SGS  [LEDM350X280X190-2]
LED2  AA3528SGS  [LEDM350X280X190-2]
LED3  AA3528SGS  [LEDM350X280X190-2]
R29  180R  [RESC1608X45N]
R30  180R  [RESC1608X45N]
R31  180R  [RESC1608X45N]
R32  180R  [RESC1608X45N]
R33  10kR  [RESC1005X35N]
R34  10kR  [RESC1005X35N]
R35  10kR  [RESC1005X35N]
R36  10kR  [RESC1005X35N]
SW0  OS102011MS2QN1  [SW_OS102011MS2QN1]
SW1  OS102011MS2QN1  [SW_OS102011MS2QN1]
SW2  OS102011MS2QN1  [SW_OS102011MS2QN1]
SW3  OS102011MS2QN1  [SW_OS102011MS2QN1]
T0  B3F-5000  [SW_B3F-5000]
T1  B3F-5000  [SW_B3F-5000]
T2  B3F-5000  [SW_B3F-5000]
T3  B3F-5000  [SW_B3F-5000]

### Blocks framed on the sheet
Headers top: J2 J3
LCD: J4
LEDs: LED0-LED3 R29-R32
Slide Switches: SW0-SW3
Push Buttons: R33-R36 T0-T3
Power: J8

### Ports
BUTTONS (harness BUTTONS), J2 (harness J2), J3 (harness J3), J5 (harness J5), J6 (harness J6), J7 (harness J7), LCD (harness LCD), LEDs (harness LEDs), SLIDE_SWITCH (harness SLIDE_SWITCH)

### Harnesses
LCD: SPI5_DCX, SPI5_SCK, SPI5_MISO, SPI5_MOSI, SPI5_NCS, SPI6_NCS, TE, SPI6_SCK, SPI6_MOSI, SPI6_MISO, NRESET, I2C_SCL, I2C_SDA, INT, BL, LED
J2: PA0, PA3, PA5, PA6, PA10, PB5, PB6, PB12, PB7
J3: PG15, PC6, PC7, PC13, PD12, PD13, PD14, PD15, PE0, PE2, PE3
J5: PD0, PD1, PD2, PD3, PD4, PD5, PD6, PD7, PD8, PD9, PD10, PD11
J6: PE7, PE8, PE9, PE10, PE11, PE12, PE13, PE14, PE15, PE4, PE5, PE6
J7: PG0, PG1, PG2, PG3, PG4, PG5, PG6, PG7, PG8, PG9, PG10, PG14
LEDs: PF0, PF1, PF2, PF3
SLIDE_SWITCH: PF12, PF13, PF14, PF15
BUTTONS: PF4, PF5, PF10, PF11

### Nets
3V3: J2.13 J3.13 J4.25 J4.27 J4.29 J5.13 J6.13 J7.13 SW0.1(Signal) SW1.1(Signal) SW2.1(Signal) SW3.1(Signal) T0.1 T0.2 T1.1 T1.2 T2.1 T2.2 T3.1 T3.2
5V: J2.16 J3.16 J4.2 J4.4 J4.6 J4.8 J5.16 J6.16 J7.16
GND: J2.14 J2.15 J3.14 J3.15 J4.1 J4.3 J4.5 J4.24 J4.26 J4.28 J4.30 J5.14 J5.15 J6.14 J6.15 J7.14 J7.15 J8.1 J8.2 R29.2 R30.2 R31.2 R32.2 R33.2 R34.2 R35.2 R36.2 SW0.3(Signal) SW0.MP SW1.3(Signal) SW1.MP SW2.3(Signal) SW2.MP SW3.3(Signal) SW3.MP
LCD.BL: J4.7 ; port LCD.BL
LCD.I2C_SDA: J2.8 J4.21 ; port LCD.I2C_SDA, port J2.PB7  [also labelled PB7]
LCD.I2C_SLC: J2.7 J4.20 ; port LCD.I2C_SCL, port J2.PB6  [also labelled PB6]  [project net LCD.I2C_SCL]
LCD.INT: J4.22 ; port LCD.INT
LCD.LED: J4.23 ; port LCD.LED
LCD.NRESET: J4.10 ; port LCD.NRESET
LCD.SPI5_DCX: J4.15 ; port LCD.SPI5_DCX
LCD.SPI5_MISO: J4.12 ; port LCD.SPI5_MISO
LCD.SPI5_MOSI: J4.13 ; port LCD.SPI5_MOSI
LCD.SPI5_NCS: J4.14 ; port LCD.SPI5_NCS
LCD.SPI5_SCK: J4.11 ; port LCD.SPI5_SCK
LCD.SPI6_MISO: J2.4 J4.17 ; port LCD.SPI6_MISO, port J2.PA6  [also labelled PA6]
LCD.SPI6_MOSI: J2.6 J4.18 ; port LCD.SPI6_MOSI, port J2.PB5  [also labelled PB5]
LCD.SPI6_NCS: J4.19 ; port LCD.SPI6_NCS
LCD.SPI6_SCK: J2.3 J4.16 ; port LCD.SPI6_SCK, port J2.PA5  [also labelled PA5]
LCD.TE: J4.9 ; port LCD.TE
PA0: J2.1 ; port J2.PA0
PA3: J2.2 ; port J2.PA3
PA10: J2.5 ; port J2.PA10
PB12: J2.9 ; port J2.PB12
PC6: J3.1 ; port J3.PC6
PC7: J3.2 ; port J3.PC7
PC13: J3.3 ; port J3.PC13
PD0: J5.1 ; port J5.PD0
PD1: J5.2 ; port J5.PD1
PD2: J5.3 ; port J5.PD2
PD3: J5.4 ; port J5.PD3
PD4: J5.5 ; port J5.PD4
PD5: J5.6 ; port J5.PD5
PD6: J5.7 ; port J5.PD6
PD7: J5.8 ; port J5.PD7
PD8: J5.9 ; port J5.PD8
PD9: J5.10 ; port J5.PD9
PD10: J5.11 ; port J5.PD10
PD11: J5.12 ; port J5.PD11
PD12: J3.4 ; port J3.PD12
PD13: J3.5 ; port J3.PD13
PD14: J3.6 ; port J3.PD14
PD15: J3.7 ; port J3.PD15
PE0: J3.8 ; port J3.PE0
PE2: J3.9 ; port J3.PE2
PE3: J3.10 ; port J3.PE3
PE4: J6.10 ; port J6.PE4
PE5: J6.11 ; port J6.PE5
PE6: J6.12 ; port J6.PE6
PE7: J6.1 ; port J6.PE7
PE8: J6.2 ; port J6.PE8
PE9: J6.3 ; port J6.PE9
PE10: J6.4 ; port J6.PE10
PE11: J6.5 ; port J6.PE11
PE12: J6.6 ; port J6.PE12
PE13: J6.7 ; port J6.PE13
PE14: J6.8 ; port J6.PE14
PE15: J6.9 ; port J6.PE15
PF0: LED0.2(A) ; port LEDs.PF0
PF1: LED1.2(A) ; port LEDs.PF1
PF2: LED2.2(A) ; port LEDs.PF2
PF3: LED3.2(A) ; port LEDs.PF3
PF4: R36.1 T0.3 T0.4 ; port BUTTONS.PF4
PF5: R35.1 T1.3 T1.4 ; port BUTTONS.PF5
PF10: R34.1 T2.3 T2.4 ; port BUTTONS.PF10
PF11: R33.1 T3.3 T3.4 ; port BUTTONS.PF11
PF12: SW0.2(COM) ; port SLIDE_SWITCH.PF12
PF13: SW1.2(COM) ; port SLIDE_SWITCH.PF13
PF14: SW2.2(COM) ; port SLIDE_SWITCH.PF14
PF15: SW3.2(COM) ; port SLIDE_SWITCH.PF15
PG0: J7.1 ; port J7.PG0
PG1: J7.2 ; port J7.PG1
PG2: J7.3 ; port J7.PG2
PG3: J7.4 ; port J7.PG3
PG4: J7.5 ; port J7.PG4
PG5: J7.6 ; port J7.PG5
PG6: J7.7 ; port J7.PG6
PG7: J7.8 ; port J7.PG7
PG8: J7.9 ; port J7.PG8
PG9: J7.10 ; port J7.PG9
PG10: J7.11 ; port J7.PG10
PG14: J7.12 ; port J7.PG14
PG15: J3.11 ; port J3.PG15
NetLED0_1: LED0.1(K) R29.1
NetLED1_1: LED1.1(K) R30.1
NetLED2_1: LED2.1(K) R31.1
NetLED3_1: LED3.1(K) R32.1

Not connected (* = marked no-connect by the designer): J2 10* 11* 12*; J3 12*

### Layout directives
net class J2 Signals: PA0, PA3, PA5, PA6, PA10, PB5, PB6, PB7, PB12
net class J3 Signals: PC6, PC7, PC13, PD12, PD13, PD14, PD15, PE0, PE2, PE3, PG15

### Notes on the sheet
- (near J5) PORT D
- SPI6_MISO
- Headers
- SPI6_SCK
- SPI6_MOSI
- SPI6_SDA
- (near J6) PORT E
- SPI4_SCK
- PB15 TIM / SPI2_MOSI CHECK WHAT IS NEEDED FOR LED COMMUNICATION
- SPI4_MISO
- SPI4_MOSI
- (near J7) PORT G
- Sheet Name
- Project Name
- Variant:
- Doc Number
- File:
- Repo:
- Revision:
- Date:
- Author:
- VC Rev:
- Sheet

### Library data of the parts
J2 J3 = CMP-00636-4: Header, 2x8Pin, Pitch 2.54mm, Female, Vertical, THT; Manufacturer: TE Connectivity; Mating Length: 8.36m; Plating: Gold; Pin Mapping: 2x8; Angle: Vertical; Insulation Height: 8.64m; Pitch: 2.54mm; Pins: 16; Gender: Female; Pitch Row: 2.54mm; Mounting Technology: THT
J4 = CMP-001-0083-9: Board to Board, SlimStack, 2x15 Pin, Pitch 0.5mm, Female, 0.5A, 50V, Vertical, SMD, L10.1B4.1H2; Manufacturer: Molex; Mating Part: 500334, 53885; Pitch: 500µm; Connection: Pluggable; Max Current: 500mA; Pin Mapping: 2x15; Mounting Technology: SMD; Pins: 30; Angle: Vertical; Size: L10.1B4.1H2; Family Name: SlimStack; Gender: Female; Type: Board to Board; Max Voltage: 50V
J5-J7 = CMP-00747-6: Box Header 4-Wall, 2x8 Pin, Pitch 2.54mm, Male, Vertical, THT, L27.64b8.59H9.91; Manufacturer: 3M; Connection: Pluggable; Pins: 16; Gender: Male; Type: Wire to Board; Size: L25.6B8.59H9.91; Angle: Vertical; Pitch: 2.54mm; Mounting Technology: THT
J8 = CMP-002-00113-16: Header, 1x2 Pin, Pitch 2.54mm, Male, Vertical, THT; Manufacturer: FCI; Overall Contact Length: 11.43mm; Mating Length: 5.84mm; Pins: 2; Angle: Vertical; Pitch Row: 2.54mm; Pitch: 2.54mm; Gender: Male; Insulation Height: 2.54mm; Mounting Technology: THT; Pin Mapping: 1x2; Termination Length: 3.05mm
LED0-LED3 = CMP-00744-7: LED, green 565nm, 25mA, 2.2V, L3.5B2.8H1.9; Size: L3.5B2.8H1.9; Forward Voltage: 2.2V; Color: Green; Case/Package: SMD-2; Rated Current: 25mA; Wavelength: 565nm; Mounting Technology: SMD
R29-R32 = CMP-009-00559-5: Res, 180R, 1%, 100mW, 0603; Voltage Rating: 75V; Value: 180; Mounting Technology: SMD; Case Code (Metric): 1608; Power: 100mW; Type: Fixed; Case/Package: 0603; Tolerance: 1%
R33-R36 = CMP-009-00298-12: as R69 on sheet USB; Tolerance: 1%; Type: Fixed; Case Code (Metric): 1005; Case/Package: 0402; Mounting Technology: SMD
SW0-SW3 = CMP-00742-3: Slide Switch, Vertical, SPDT 2P, 12V, 100mA, L8.6B4.3H8; Illuminated: No; Number of Positions: 2; Angle: Vertical; Size: L8.6B4.3H8; Contact Form: SPDT; Current Rating: 100mA; Actuation: Slide; Type: Switch; Mounting Technology: THT; Contact Material: Silver; Voltage Rating: 12V
T0-T3 = CMP-00738-5: Push Button, Vertical, SPST-NO, 4P, 24V, 50mA, L12B12H4.3; Contact Form: SPST; Number of Positions: 4; Pitch: 5; Illuminated: No; Mounting Technology: THT; Size: L12B12H4.3; Current Rating: 50mA; Voltage Rating: 24V; Angle: Vertical; Actuation: Push; Contact Material: Silver; Type: Button

## Sheet J-Link-OB.SchDoc
size A3; SheetNumber: 8; SheetTotal: 8; DocumentSheetName: J-Link OB; DocumentAuthor: frtt
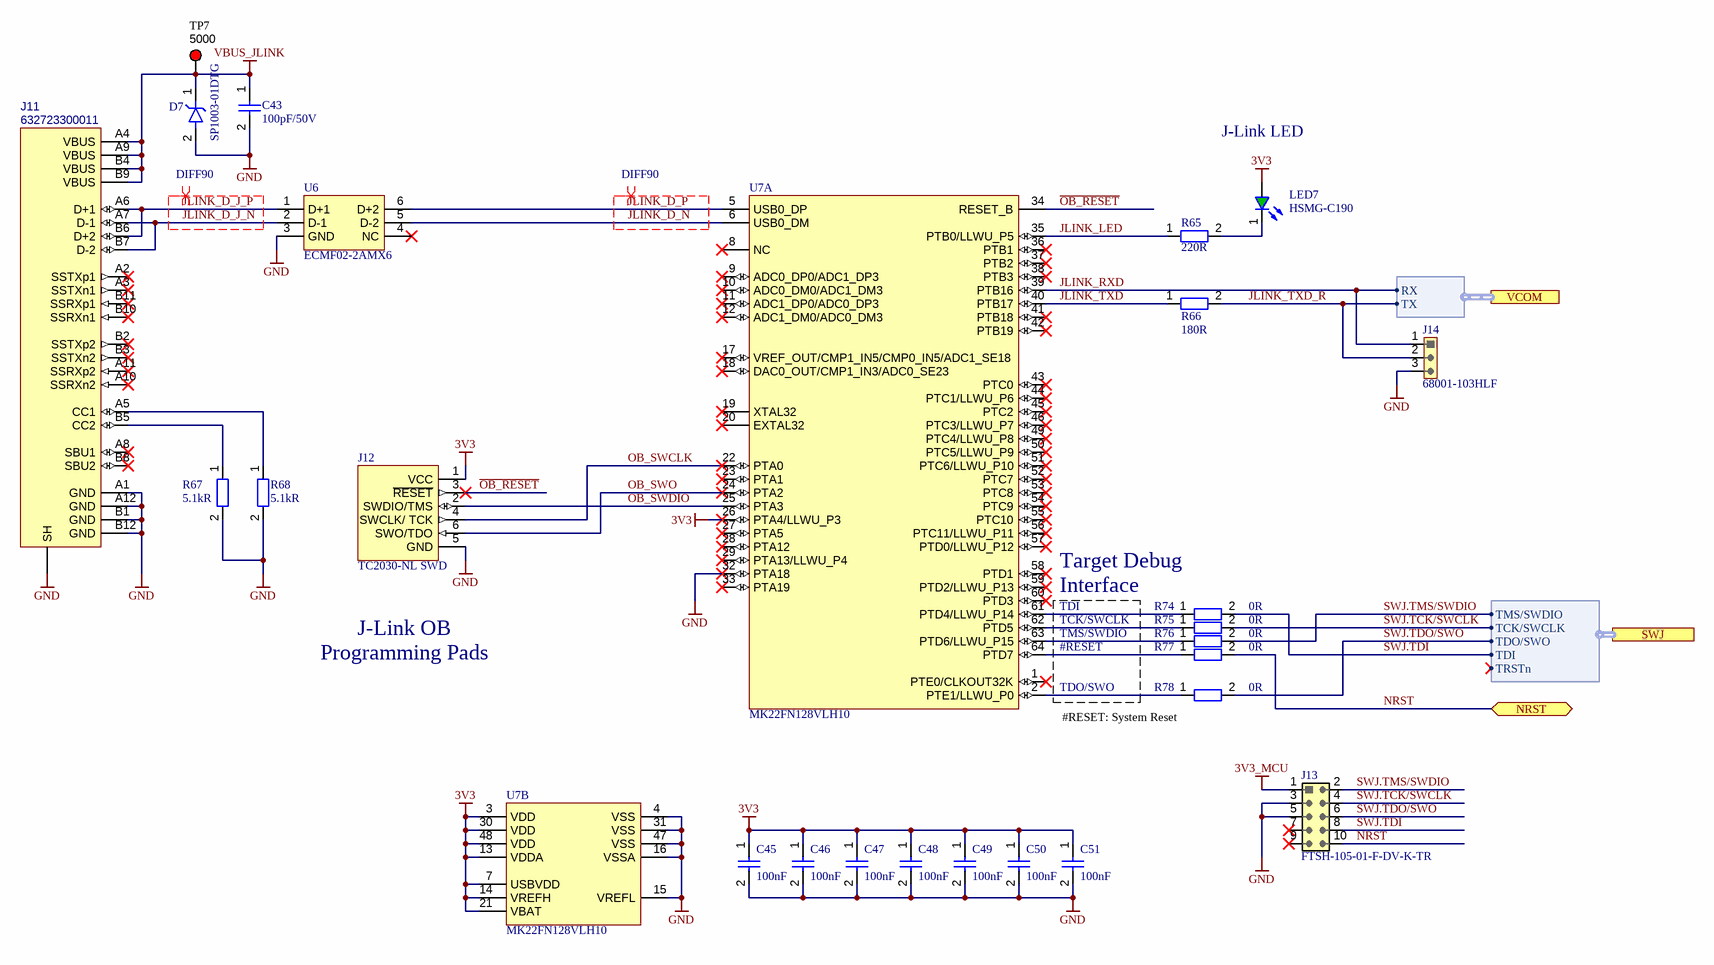
[diagram p4: J-Link-OB.SchDoc]

### Parts
C43  100pF/50V  [CAPC1005X50N]
C45  value 100nF  [CAPC1005X50N]  (hidden comment: 100nF/16V)
C46  value 100nF  [CAPC1005X50N]  (hidden comment: 100nF/16V)
C47  value 100nF  [CAPC1005X50N]  (hidden comment: 100nF/16V)
C48  value 100nF  [CAPC1005X50N]  (hidden comment: 100nF/16V)
C49  value 100nF  [CAPC1005X50N]  (hidden comment: 100nF/16V)
C50  value 100nF  [CAPC1005X50N]  (hidden comment: 100nF/16V)
C51  value 100nF  [CAPC1005X50N]  (hidden comment: 100nF/16V)
D7  SP1003-01DTG  [SOD14060X55N]
J11  632723300011  [WE_632723300011]
J12  TC2030-NL SWD  [TC2030-NL]  (no BOM)
J13  FTSH-105-01-F-DV-K-TR  [FP-FTSH-105-01-F-DV-K-TR-MFG]
J14  68001-103HLF  [HD254_1x3_MV]
LED7  HSMG-C190  [LEDSC160X80X80-2Lgn]
R65  220R  [RESC1608X45N]
R66  180R  [RESC1608X45N]
R67  5.1kR  [RESC1005X35N]
R68  5.1kR  [RESC1005X35N]
R74  0R  [RESC1005X35N]
R75  0R  [RESC1005X35N]
R76  0R  [RESC1005X35N]
R77  0R  [RESC1005X35N]
R78  0R  [RESC1005X35N]
TP7  5000  [KSTN-5000]
U6  ECMF02-2AMX6  [QFN50P150X170X50-6N]
U7  MK22FN128VLH10  [QFP50P1200X1200X160-64L]  (parts A,B of 2)

### Ports
NRST (bidir), SWJ (harness SWJ), VCOM (harness VCOM)

### Harnesses
VCOM: RX, TX
SWJ: TMS/SWDIO, TCK/SWCLK, TDO/SWO, TDI, TRSTn

### Nets
3V3: C45.1 C46.1 C47.1 C48.1 C49.1 C50.1 C51.1 J12.1(VCC) LED7.2(A) U7.3(VDD) U7.7(USBVDD) U7.13(VDDA) U7.14(VREFH) U7.21(VBAT) U7.26(PTA4/LLWU_P3) U7.30(VDD) U7.48(VDD)
3V3_MCU: J13.1
GND: C43.2 C45.2 C46.2 C47.2 C48.2 C49.2 C50.2 C51.2 D7.2(A) J11.A1(GND) J11.A12(GND) J11.B1(GND) J11.B12(GND) J11.SH J12.5(GND) J13.3 J13.5 J14.3 R67.2 R68.2 U6.3(GND) U7.4(VSS) U7.15(VREFL) U7.16(VSSA) U7.31(VSS) U7.32(PTA18) U7.47(VSS)
VBUS_JLINK: C43.1 D7.1(A) J11.A4(VBUS) J11.A9(VBUS) J11.B4(VBUS) J11.B9(VBUS) TP7.1
JLINK_D_J_N: J11.A7(D-1) J11.B7(D-2) U6.2(D-1)
JLINK_D_J_P: J11.A6(D+1) J11.B6(D+2) U6.1(D+1)
JLINK_D_N: U6.5(D-2) U7.6(USB0_DM)
JLINK_D_P: U6.6(D+2) U7.5(USB0_DP)
JLINK_LED: R65.1 U7.35(PTB0/LLWU_P5)
JLINK_RXD: J14.1 U7.39(PTB16) ; port VCOM.RX
JLINK_TXD: R66.1 U7.40(PTB17)
JLINK_TXD_R: J14.2 R66.2 ; port VCOM.TX
NRST: J13.10 R77.2 ; port NRST
~{OB_RESET}: J12.3(~{RESET}) U7.34(RESET_B)
OB_SWCLK: J12.4(SWCLK/_TCK) U7.22(PTA0)
OB_SWDIO: J12.2(SWDIO/TMS) U7.25(PTA3)
OB_SWO: J12.6(SWO/TDO) U7.24(PTA2)
SWJ.TCK/SWCLK: J13.4 R75.2 ; port SWJ.TCK/SWCLK
SWJ.TDI: J13.8 R74.2 ; port SWJ.TDI
SWJ.TDO/SWO: J13.6 R78.2 ; port SWJ.TDO/SWO
SWJ.TMS/SWDIO: J13.2 R76.2 ; port SWJ.TMS/SWDIO
NetJ11_A5: J11.A5(CC1) R68.1
NetJ11_B5: J11.B5(CC2) R67.1
NetLED7_1: LED7.1(K) R65.2
NetR74_1: R74.1 U7.61(PTD4/LLWU_P14)
NetR75_1: R75.1 U7.62(PTD5)
NetR76_1: R76.1 U7.63(PTD6/LLWU_P15)
NetR77_1: R77.1 U7.64(PTD7)
NetR78_1: R78.1 U7.2(PTE1/LLWU_P0)

Not connected (* = marked no-connect by the designer): J11 A2(SSTXp1)* A3(SSTXn1)* A8(SBU1)* A10(SSRXn2)* A11(SSRXp2)* B2(SSTXp2)* B3(SSTXn2)* B8(SBU2)* B10(SSRXn1)* B11(SSRXp1)*; J13 7* 9*; U6 4(NC)*; U7 1(PTE0/CLKOUT32K)* 8(NC)* 9(ADC0_DP0/ADC1_DP3)* 10(ADC0_DM0/ADC1_DM3)* 11(ADC1_DP0/ADC0_DP3)* 12(ADC1_DM0/ADC0_DM3)* 17(VREF_OUT/CMP1_IN5/CMP0_IN5/ADC1_SE18)* 18(DAC0_OUT/CMP1_IN3/ADC0_SE23)* 19(XTAL32)* 20(EXTAL32)* 23(PTA1)* 27(PTA5)* 28(PTA12)* 29(PTA13/LLWU_P4)* 33(PTA19)* 36(PTB1)* 37(PTB2)* 38(PTB3)* 41(PTB18)* 42(PTB19)* 43(PTC0)* 44(PTC1/LLWU_P6)* 45(PTC2)* 46(PTC3/LLWU_P7)* 49(PTC4/LLWU_P8)* 50(PTC5/LLWU_P9)* 51(PTC6/LLWU_P10)* 52(PTC7)* 53(PTC8)* 54(PTC9)* 55(PTC10)* 56(PTC11/LLWU_P11)* 57(PTD0/LLWU_P12)* 58(PTD1)* 59(PTD2/LLWU_P13)* 60(PTD3)*

### Layout directives
differential pair; differential pair class DIFF90: JLINK_D_J_N, JLINK_D_J_P, JLINK_D_N, JLINK_D_P

### Notes on the sheet
- J-Link LED
- (near R74) Target Debug Interface
- J-Link OB Programming Pads
- (near U7) TDI
- (near U7) TCK/SWCLK
- (near U7) TMS/SWDIO
- (near U7) #RESET
- (near R78) #RESET: System Reset
- (near U7) TDO/SWO
- Sheet Name
- Project Name
- Variant:
- Doc Number
- File:
- Repo:
- Revision:
- Date:
- Author:
- VC Rev:
- Sheet

### Library data of the parts
C43 = CMP-001-00089-19: Cap MLCC, 100pF, 50V, C0G, 5%, 0402; Tolerance: 5%; Value: 100pF; Voltage Rating: 50V; Dielectricum: C0G; Type: MLCC; Case/Package: 0402; Mounting Technology: SMD; Case Code (Metric): 1005
C45-C51 = CMP-001-00001-22: Cap MLCC, 100nF, 16V, X7R, 5%,  0402; Dielectricum: X7R; Type: MLCC; Case Code (Metric): 1005; Voltage Rating: 16V; Case/Package: 0402; Mounting Technology: SMD; Tolerance: 5%
D7 = CMP-00873-4: TVS Diode, unidirectional, 5V, 7A, SOD723; Connection: single; Size: L1.00B0.60H0.55; Case/Package: SOD723; Mounting Technology: SMD; Peak Current: 7A; Rated Voltage: 5V; Direction: unidirectional
J11 = CMP-220-000000-8: USB-C, 24 Pin, Pitch 500um, 20V, Horizontal, SMD/THT, L11.2B8.74H2.96; Manufacturer: Wurth Elektronik; Pin Mapping: 2x12; Max Current: 5A; Connection: Pluggable; Pitch: 500µm; Gender: Female; Family Name: WR-USB Connectors; Max Voltage: 20V; Mounting Technology: SMD/THT; Angle: Horizontal; Size: L11.2B8.74H2.96; Pins: 24; Type: USB-C
J12 = CMP-002-00174-19: Land Pattern, Cortex Tag-Connect, 6 Pin, Pitch 1.27mm, no legs; Mating Part: Cortex Tag-Connect Debugger; Angle: Vertical; Connection: Pluggable; Pin Mapping: 2x3; Pitch: 1.27mm; Pins: 6; Type: Land Pattern; Family Name: Tag-Connect; Mounting Technology: SMD; Size: 0
J13 = CMP-001-0047-10: Box Header, FTSH-105, 2x5 Pin, Pitch 1.27mm, 3.4A, Vertical, SMD, L6.3B6.86H6; Manufacturer: Samtec Inc.; Connection: Pluggable; Gender: Male; Max Current: 3.4A; Angle: Vertical; Size: L6.3B6.86H6; Mounting Technology: SMD; Type: Box Header; Pitch: 1.27mm; Family Name: FTSH-105; Pins: 10
J14 = CMP-002-00127-12: as JP2 on sheet USB; Termination Length: 3.05mm; Pitch Row: 2.54mm; Pin Mapping: 1x3; Pins: 3; Mounting Technology: THT; Angle: Vertical; Pitch: 2.54mm; Insulation Height: 2.54mm; Gender: Male
LED7 = CMP-007-00013-24: LED, Green, 20mA, 2.2V, 0603; Case/Package: 0603; Rated Current: 20mA; Forward Voltage: 2.2V; Size: L1.6B0.8H0.8; Color: Green; Mounting Technology: SMD
R65 = CMP-009-00452-5: as R27 on sheet Power; Mounting Technology: SMD; Case Code (Metric): 1608; Case/Package: 0603; Tolerance: 1%; Type: Fixed
R66 = CMP-009-00559-5: as R29 on sheet UI_and_IO-Connectors; Mounting Technology: SMD; Case Code (Metric): 1608; Power: 100mW; Type: Fixed; Case/Package: 0603; Tolerance: 1%
R67 R68 = CMP-009-00255-13: as R63 on sheet USB; Case/Package: 0402; Case Code (Metric): 1005; Tolerance: 1%; Mounting Technology: SMD; Type: Fixed
R74-R78 = CMP-009-00148-34: as R79 on sheet Power; Case/Package: 0402; Tolerance: 1%; Mounting Technology: SMD; Case Code (Metric): 1005; Type: Fixed
TP7 = CMP-00067-9: as TP6 on sheet USB; Mounting Technology: THT; Color: Red; Size: D2.5H4.6
U6 = CMP-00721-6: as U5 on sheet USB; Specification: 6Vbr, 1.8ohm, 8kVpp; Type: ESD Common Mode Filter; Size: L1.7B1.5H0.5; Case/Package: uQFN-6L; Mounting Technology: SMD; Connection: Diodes and CM-Chocke
U7 = CMP-00769-8: Microcontroller, ARM Cortex-M4, 32MHz, Flash 128kB, RAM 24kB, QFN-64; Min Supply Voltage: 1.71V; Bit: 64; Max Supply Voltage: 3.6V; Frequency: 100MHz; Mounting Technology: SMD; RAM Size: 24kB; Type: Microcontroller; Size: L10B10H1.4; Case/Package: QFN-64; Family: ARM Cortex-M4; Flash Size: 128kB

## Sheet Ethernet.SchDoc
size A3; SheetNumber: 6; SheetTotal: 8; DocumentSheetName: Ethernet; DocumentAuthor: frtt
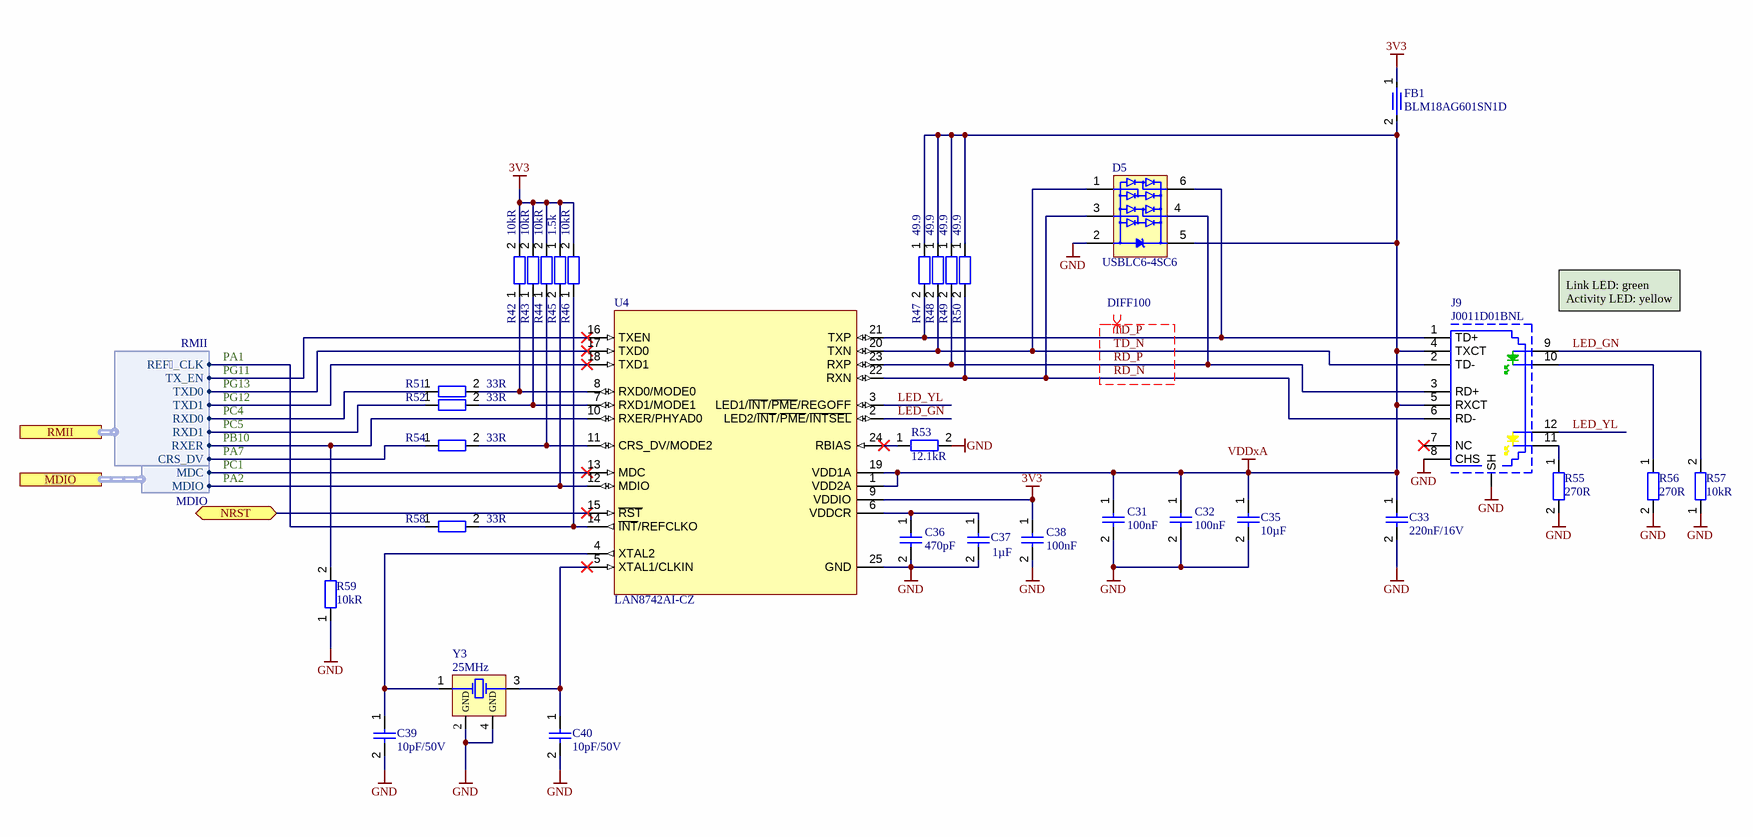
[diagram p5: Ethernet.SchDoc]

### Parts
C31  value 100nF  [CAPC1005X50N]  (hidden comment: 100nF/16V)
C32  value 100nF  [CAPC1005X50N]  (hidden comment: 100nF/16V)
C33  220nF/16V  [CAPC1005X50N]
C35  value 10µF  [CAPC1608X80N]  (hidden comment: 10uF/10V)
C36  value 470pF  [CAPC1005X50N]  (hidden comment: 470pF/50V)
C37  value 1µF  [CAPC1608X80N]  (hidden comment: 1uF/16V)
C38  value 100nF  [CAPC1608X80N]  (hidden comment: 100nF/50V)
C39  10pF/50V  [CAPC1005X50N]
C40  10pF/50V  [CAPC1005X50N]
D5  USBLC6-4SC6  [SOT95P280X120-6L]
FB1  BLM18AG601SN1D  [INDC1608X08L]
J9  J0011D01BNL  [PULSE_J0011D01BNL]
R42  10kR  [RESC1005X35N]
R43  10kR  [RESC1005X35N]
R44  10kR  [RESC1005X35N]
R45  value 1.5k  [RESC1005X35N]  (hidden comment: 1.5kR)
R46  10kR  [RESC1005X35N]
R47  value 49.9  [RESC1005X35N]  (hidden comment: 49.9R/0.1%)
R48  value 49.9  [RESC1005X35N]  (hidden comment: 49.9R/0.1%)
R49  value 49.9  [RESC1005X35N]  (hidden comment: 49.9R/0.1%)
R50  value 49.9  [RESC1005X35N]  (hidden comment: 49.9R/0.1%)
R51  33R  [RESC1005X35N]
R52  33R  [RESC1005X35N]
R53  12.1kR  [RESC1005X35N]
R54  33R  [RESC1005X35N]
R55  270R  [RESC1005X35N]
R56  270R  [RESC1005X35N]
R57  10kR  [RESC1005X35N]
R58  33R  [RESC1005X35N]
R59  10kR  [RESC1005X35N]
U4  LAN8742AI-CZ  [QFN50P400X400X90-25T260X260L]
Y3  Frequency: 25MHz  [OSCCC160X120X45-4]  (hidden comment: ABM12W-25.0000MHZ-8-B1U-T3)

### Ports
MDIO (harness MDIO), NRST (bidir), RMII (harness RMII)

### Harnesses
RMII: REF_CLK, TX_EN, TXD0, TXD1, RXD0, CRS_DV, RXD1, RXER
MDIO: MDC, MDIO

### Nets
3V3: C38.1 FB1.1 R42.2 R43.2 R44.2 R45.1 R46.2 U4.9(VDDIO)
GND: C31.2 C32.2 C33.2 C35.2 C36.2 C37.2 C38.2 C39.2 C40.2 D5.2(GND) J9.8(CHS) J9.SH R53.2 R55.2 R56.2 R57.1 R59.1 U4.25(GND) Y3.2(GND) Y3.4(GND)
VDDxA: C31.1 C32.1 C33.1 C35.1 D5.5(VBUS) FB1.2 J9.4(TXCT) J9.5(RXCT) R47.1 R48.1 R49.1 R50.1 U4.1(VDD2A) U4.19(VDD1A)
LED_GN: J9.9 R57.2 U4.2(LED2/~{INT}/~{PME}/~{INTSEL})
LED_YL: J9.12 U4.3(LED1/~{INT}/~{PME}/REGOFF)
MDIO.MDC: U4.13(MDC) ; port MDIO.MDC
MDIO.MDIO: R45.2 U4.12(MDIO) ; port MDIO.MDIO
NRST: U4.15(~{RST}) ; port NRST
RD_N: D5.3(I/O2) J9.6(RD-) R50.2 U4.22(RXN)
RD_P: D5.4(I/O3) J9.3(RD+) R49.2 U4.23(RXP)
RMII.CRS_DV: R54.1 ; port RMII.CRS_DV
RMII.REF_CLK: R58.1 ; port RMII.REF_CLK
RMII.RXD0: R51.1 ; port RMII.RXD0
RMII.RXD1: R52.1 ; port RMII.RXD1
RMII.RXER: R59.2 U4.10(RXER/PHYAD0) ; port RMII.RXER
RMII.TX_EN: U4.16(TXEN) ; port RMII.TX_EN
RMII.TXD0: U4.17(TXD0) ; port RMII.TXD0
RMII.TXD1: U4.18(TXD1) ; port RMII.TXD1
TD_N: D5.1(I/O1) J9.2(TD-) R48.2 U4.20(TXN)
TD_P: D5.6(I/O4) J9.1(TD+) R47.2 U4.21(TXP)
NetC36_1: C36.1 C37.1 U4.6(VDDCR)
NetC39_1: C39.1 U4.4(XTAL2) Y3.1(X1)
NetC40_1: C40.1 U4.5(XTAL1/CLKIN) Y3.3(X2)
NetJ9_10: J9.10 R56.1
NetJ9_11: J9.11 R55.1
NetR42_1: R42.1 R51.2 U4.8(RXD0/MODE0)
NetR43_1: R43.1 R52.2 U4.7(RXD1/MODE1)
NetR44_1: R44.1 R54.2 U4.11(CRS_DV/MODE2)
NetR46_1: R46.1 R58.2 U4.14(~{INT}/REFCLKO)
NetR53_1: R53.1 U4.24(RBIAS)

Not connected (* = marked no-connect by the designer): J9 7(NC)*

### Layout directives
differential pair; differential pair class DIFF100: RD_N, RD_P, TD_N, TD_P

### Notes on the sheet
- (near J9) Link LED: green
  Activity LED: yellow
- PG13
- PG11
- PC4
- PA1
- PG12
- PC5
- PB10
- PA7
- PC1
- PA2
- Sheet Name
- Project Name
- Variant:
- Doc Number
- File:
- Repo:
- Revision:
- Date:
- Author:
- VC Rev:
- Sheet

### Library data of the parts
C31 C32 = CMP-001-00001-22: Cap MLCC, 100nF, 16V, X7R, 5%,  0402; Dielectricum: X7R; Type: MLCC; Case Code (Metric): 1005; Voltage Rating: 16V; Case/Package: 0402; Mounting Technology: SMD; Tolerance: 5%
C33 = CMP-00178-7: Cap MLCC, 220nF, 16V, X7R, 10%, 0402; Value: 220nF; Case/Package: 0402; Tolerance: 10%; Type: MLCC; Dielectricum: X7R; Case Code (Metric): 1005; Mounting Technology: SMD; Voltage Rating: 16V
C35 = CMP-001-00075-19: Cap MLCC, 10uF, 10V, X5R, 10%, 0603; Mounting Technology: SMD; Type: MLCC; Case Code (Metric): 1608; Voltage Rating: 10V; Tolerance: 10%; Dielectricum: X5R; Case/Package: 0603
C36 = CMP-00111-11: Cap MLCC, 470pF, 50V, COG, 1%, 0402; Dielectricum: C0G; Type: MLCC; Case/Package: 0402; Mounting Technology: SMD; Voltage Rating: 50V; Tolerance: 1%; Case Code (Metric): 1005
C37 = CMP-001-00004-21: Cap MLCC, 1uF, 16V, X7R, 10%, 0603; Type: MLCC; Mounting Technology: SMD; Case Code (Metric): 1608; Tolerance: 10%; Dielectricum: X7R; Case/Package: 0603; Voltage Rating: 16V
C38 = CMP-001-00017-21: Cap MLCC, 100nF, 50V, X7R, 10%, 0603; Voltage Rating: 50V; Dielectricum: X7R; Tolerance: 10%; Type: MLCC; Mounting Technology: SMD; Case Code (Metric): 1608; Case/Package: 0603
C39 C40 = CMP-001-00011-22: Cap MLCC, 10pF, 50V, C0G, 2.5%, 0402; Case/Package: 0402; Mounting Technology: SMD; Dielectricum: C0G; Voltage Rating: 50V; Case Code (Metric): 1005; Type: MLCC; Value: 10pF; Tolerance: 2.5%
D5 = CMP-00732-4: TVS Diode, unidirectional, 4 Signal + 2 Supply, 6Vbr, 5A, SOT23-6L, 4 data-line very low capacitance ESD protection; Rated Voltage: 6V; Peak Current: 5A; Direction: unidirectional; Mounting Technology: SMD; Size: L2.9B1.6H1.2; Case/Package: SOT-23-6L; Connection: 4 Signal + 2 Supply
FB1 = CMP-006-00088-4: Ferrite Bead, 0.38R @ DC, 600R @ 100MHz, 25%, 0603; Current: 500mA; Impedance DC: 0.38; Case/Package: 0603; Mounting Technology: SMD; Impedance: 600R @ 100MHz; Tolerance: 25%; Case Code (Metric): 1608
J9 = CMP-00777-4: RJ45, 12 Pin, Female, Horizontal, THT, L22B16H14, with Magnetics, Shielded, 2 LED gn/ye; Manufacturer: Pulse; Connection: Pluggable; Pin Mapping: 2x4; Mounting Technology: THT; Angle: Horizontal; Size: L22B16H14; Gender: Female; Type: RJ45; Pins: 12
R42-R44 R46 R57 R59 = CMP-009-00298-12: as R69 on sheet USB; Tolerance: 1%; Type: Fixed; Case Code (Metric): 1005; Case/Package: 0402; Mounting Technology: SMD
R45 = CMP-009-00284-14: Res, 1.5kR, 1%, 0.063W, 0402; Power: 63mW; Voltage Rating: 50V; Tolerance: 1%; Case/Package: 0402; Type: Fixed; Case Code (Metric): 1005; Mounting Technology: SMD
R47-R50 = CMP-009-00337-8: Res, 49.9R, 0.1%, 0.063W, 0402; Voltage Rating: 50V; Power: 63mW; Tolerance: 0.1%; Mounting Technology: SMD; Case/Package: 0402; Case Code (Metric): 1005; Type: Fixed
R51 R52 R54 R58 = CMP-009-00029-35: Res, 33R, 1%, 0.063W, 0402; Power: 63mW; Value: 33; Voltage Rating: 50V; Case/Package: 0402; Case Code (Metric): 1005; Type: Fixed; Tolerance: 1%; Mounting Technology: SMD
R53 = CMP-009-00371-6: Res, 12.1kR, 1%, 0.063W, 0402; Voltage Rating: 50V; Value: 12.1k; Power: 63mW; Type: Fixed; Case/Package: 0402; Mounting Technology: SMD; Tolerance: 1%; Case Code (Metric): 1005
R55 R56 = CMP-009-00408-6: Res, 270R, 1%, 0.063W, 0402; Power: 63mW; Voltage Rating: 50V; Value: 270; Tolerance: 1%; Type: Fixed; Case Code (Metric): 1005; Mounting Technology: SMD; Case/Package: 0402
U4 = CMP-00241-15: Bus Interface, Ethernet PHY, 1.62.. 3.6V, VQFN-24, L4B4H1; Min Supply Voltage: 1.62V; Channels: 1; Bus Type: Ethernet PHY; Case/Package: VQFN; Size: L4B4H1; Mounting Technology: SMD; Max Supply Voltage: 3.6V
Y3 = CMP-00838-4: Crystal Quartz, 25MHz, ±10ppm, 8pF, SMD-4, L1.6B1.2H0.4; ESR: 80; Type: Quartz; Size: L1.6B1.2H0.4; Tolerance: 10ppm; Load Capacitance: 8pF; Case/Package: SMD-4; Mounting Technology: SMD

## Sheet microSD.SchDoc
size A3; SheetNumber: 5; SheetTotal: 8; DocumentSheetName: microSD; DocumentAuthor: frtt
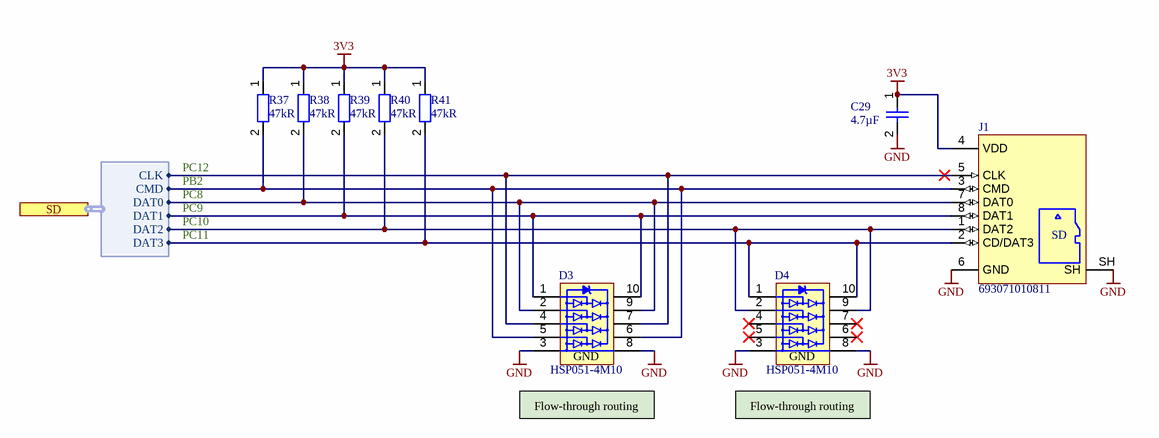
[diagram p6: microSD.SchDoc]

### Parts
C29  value 4.7µF  [CAPC1608X80N]  (hidden comment: 4.7uF/16V)
D3  HSP051-4M10  [QFN50P100X250X50-10]
D4  HSP051-4M10  [QFN50P100X250X50-10]
J1  693071010811  [WE_693071010811]
R37  47kR  [RESC1005X35N]
R38  47kR  [RESC1005X35N]
R39  47kR  [RESC1005X35N]
R40  47kR  [RESC1005X35N]
R41  47kR  [RESC1005X35N]

### Ports
SD (harness SD-Bus)

### Harnesses
SD-Bus: DAT0, DAT1, DAT2, DAT3, CLK, CMD

### Nets
3V3: C29.1 J1.4(VDD) R37.1 R38.1 R39.1 R40.1 R41.1
GND: C29.2 D3.3(GND) D3.8(GND) D4.3(GND) D4.8(GND) J1.6(GND) J1.SH
SDMMC.CLK: D3.4(I/O3) D3.7(NC) J1.5(CLK) ; port SD.CLK
SDMMC.CMD: D3.5(I/O4) D3.6(NC) J1.3(CMD) R37.2 ; port SD.CMD
SDMMC.DAT0: D3.2(I/O2) D3.9(NC) J1.7(DAT0) R38.2 ; port SD.DAT0
SDMMC.DAT1: D3.1(I/O1) D3.10(NC) J1.8(DAT1) R39.2 ; port SD.DAT1
SDMMC.DAT2: D4.2(I/O2) D4.9(NC) J1.1(DAT2) R40.2 ; port SD.DAT2
SDMMC.DAT3: D4.1(I/O1) D4.10(NC) J1.2(CD/DAT3) R41.2 ; port SD.DAT3

Not connected (* = marked no-connect by the designer): D4 4(I/O3)* 5(I/O4)* 6(NC)* 7(NC)*

### Notes on the sheet
- PC12
- PB2
- PC8
- PC9
- PC10
- PC11
- (near D3) Flow-through routing
- (near D4) Flow-through routing
- Sheet Name
- Project Name
- Variant:
- Doc Number
- File:
- Repo:
- Revision:
- Date:
- Author:
- VC Rev:
- Sheet
- (in symbol CMP-002-00218-19) SD

### Library data of the parts
C29 = CMP-00443-4: Cap MLCC, 4.7uF, 16V, X7R, 10%, 0603; Voltage Rating: 16V; Mounting Technology: SMD; Tolerance: 10%; Case/Package: 0603; Type: MLCC; Case Code (Metric): 1608; Dielectricum: X7R
D3 D4 = CMP-00765-5: TVS Diode, unidirectional, 4 Signal + GND,  5.8Vbr, 16A, uQFN-10, 4-line ESD Protection for high speed lines; Rated Voltage: 5.8V; Case/Package: uQFN-10; Size: L2.5B1.0H0.47; Connection: 4 Signal + GND; Mounting Technology: SMD; Peak Current: 16A; Direction: Unidirectional
J1 = CMP-002-00218-19: SD-Card Micro Connector, 8 Position, Push In, Push Out, SMD; Manufacturer: Würth; Angle: Horizontal; Connection: Pluggable; Family Name: WR-CRD; Max Voltage: 100V; Pins: 8; Type: SD-Card; Mounting Technology: SMD; Size: L15.2B14H2.1
R37-R41 = CMP-009-00137-35: Res, 47kR, 1%, 0.063W, 0402; Value: 47k; Voltage Rating: 50V; Power: 63mW; Case Code (Metric): 1005; Tolerance: 1%; Mounting Technology: SMD; Type: Fixed; Case/Package: 0402